# Altium project DMPro16.PrjPcb (part 1 of 3)
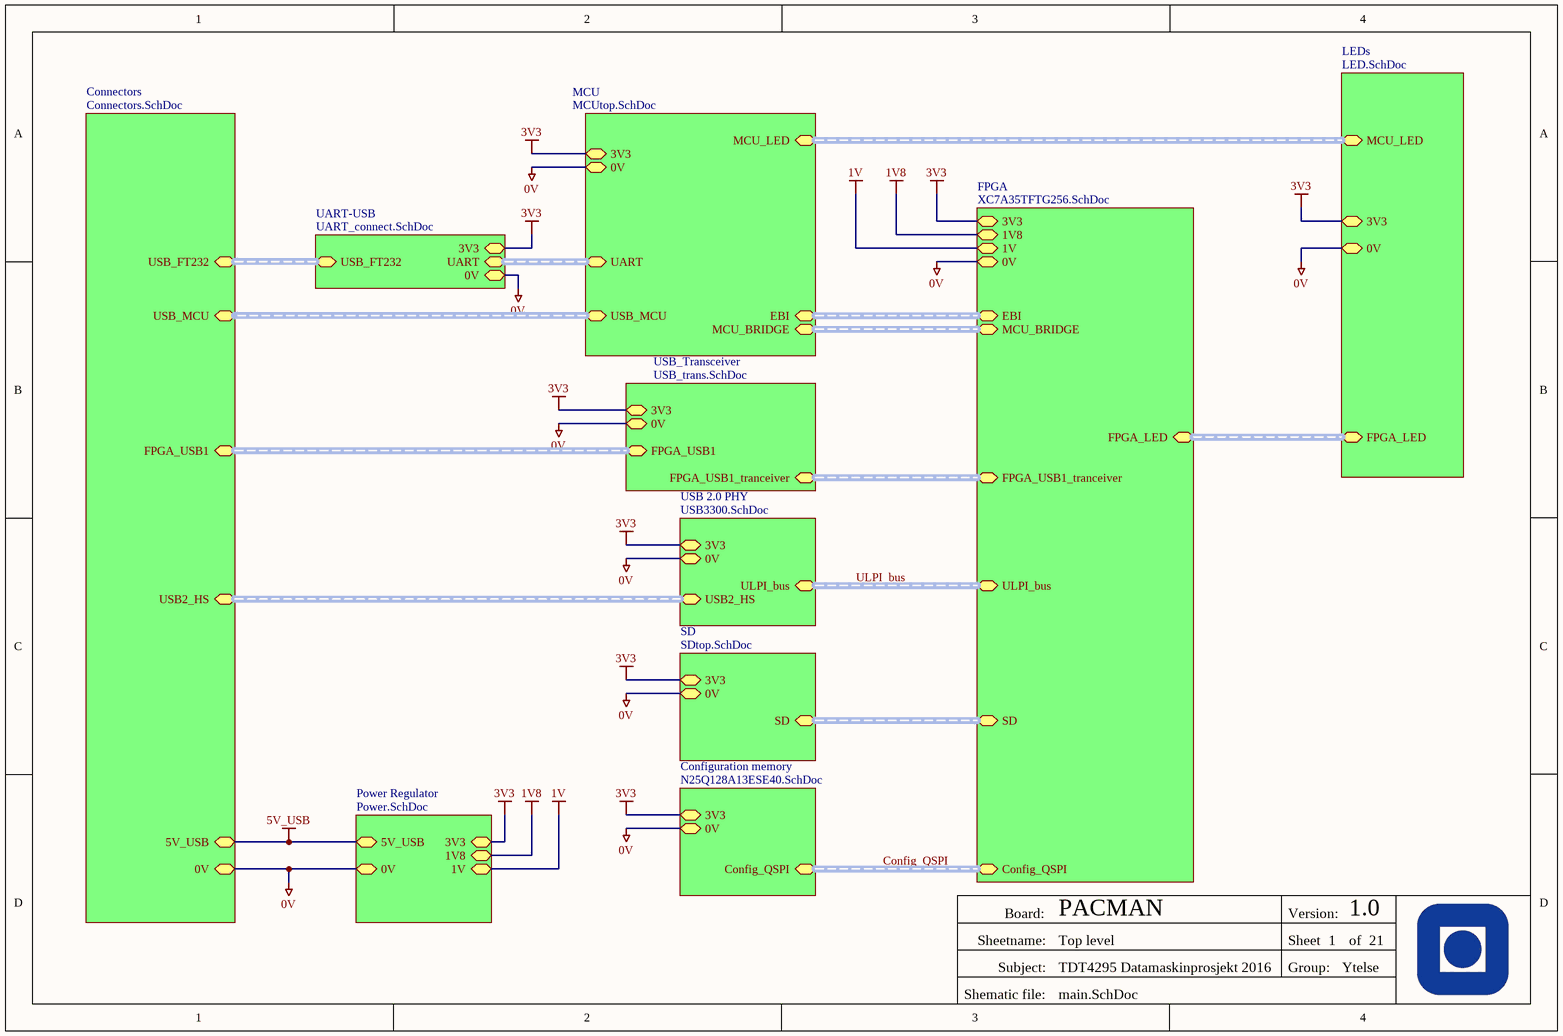
[diagram p0: main.SchDoc]
Version: 1.0; Subject: TDT4295 Datamaskinprosjekt 2016; Groupname: Ytelse; BoardName: PACMAN
21 sheets, 240 parts. Net scope: strictly hierarchical (ports join the sheet entries above them; power ports are local).
Board file: pcb.PcbDoc
Sheets:
  main.SchDoc
    MCU = MCUtop.SchDoc
      MCU Power = EFM32_power.SchDoc
      MCU IO = EFM32_IO.SchDoc
    FPGA = XC7A35TFTG256.SchDoc
      Power Supply = XC7A35TFTG256_power.SchDoc
      Configuration = XC7A35TFTG256_config.SchDoc
        BANK14 = XC7A35TFTG256_bank14.SchDoc
        BANK0 = XC7A35TFTG256_bank0.SchDoc
      XC7A35TFTG256_IO = XC7A35TFTG256_IO.SchDoc
        Bank15 = XC7A35TFTG256_bank15.SchDoc
        Bank34 = XC7A35TFTG256_bank34.SchDoc
        Bank35 = XC7A35TFTG256_bank35.SchDoc
    SD = SDtop.SchDoc
    Power Regulator = Power.SchDoc
    Configuration memory = N25Q128A13ESE40.SchDoc
    USB 2.0 PHY = USB3300.SchDoc
    LEDs = LED.SchDoc
    Connectors = Connectors.SchDoc
    USB_Transceiver = USB_trans.SchDoc
    UART-USB = UART_connect.SchDoc

## Sheet main.SchDoc
size A4; DocumentNumber: 1; SheetNumber: 1; SheetTotal: 21; SheetName: Top level

### Sub-sheets
Configuration memory = N25Q128A13ESE40.SchDoc: Config_QSPI (harness QSPI), 3V3, 0V
Connectors = Connectors.SchDoc: USB_MCU (harness USB), USB2_HS (harness USB), FPGA_USB1 (harness USB), 5V_USB, 0V, USB_FT232 (harness USB)
FPGA = XC7A35TFTG256.SchDoc: EBI (harness EBI), MCU_BRIDGE (harness MCU_CTRL_LOGIC), SD (harness SD_card), 3V3, 1V8, 1V, Config_QSPI (harness QSPI), FPGA_LED (harness LED_Harness), ULPI_bus (harness ULPI), 0V, FPGA_USB1_tranceiver (harness USB1_FS_harness)
LEDs = LED.SchDoc: FPGA_LED (harness LED_Harness), MCU_LED, 0V, 3V3
MCU = MCUtop.SchDoc: 3V3, 0V, EBI (harness EBI), MCU_BRIDGE (harness MCU_CTRL_LOGIC), USB_MCU (harness USB), MCU_LED (harness LED_Harness), UART (harness UART)
Power Regulator = Power.SchDoc: 5V_USB, 0V, 3V3, 1V8, 1V
SD = SDtop.SchDoc: SD (harness SD_card), 3V3, 0V
UART-USB = UART_connect.SchDoc: USB_FT232 (harness USB), UART (harness UART), 0V, 3V3
USB 2.0 PHY = USB3300.SchDoc: 3V3, 0V, USB2_HS (harness USB), ULPI_bus (harness ULPI)
USB_Transceiver = USB_trans.SchDoc: 3V3, 0V, FPGA_USB1 (harness USB), FPGA_USB1_tranceiver (harness USB1_FS_harness)

### Nets
0V: sheet MCU/0V, sheet FPGA/0V, sheet SD/0V, sheet Power Regulator/0V, sheet Configuration memory/0V, sheet USB 2.0 PHY/0V, sheet LEDs/0V, sheet Connectors/0V, sheet USB_Transceiver/0V, sheet UART-USB/0V
1V: sheet FPGA/1V, sheet Power Regulator/1V
1V8: sheet FPGA/1V8, sheet Power Regulator/1V8
3V3: sheet MCU/3V3, sheet FPGA/3V3, sheet SD/3V3, sheet Power Regulator/3V3, sheet Configuration memory/3V3, sheet USB 2.0 PHY/3V3, sheet LEDs/3V3, sheet USB_Transceiver/3V3, sheet UART-USB/3V3
5V_USB: sheet Power Regulator/5V_USB, sheet Connectors/5V_USB

### Buses and harness runs
harness Config_QSPI = sheet Configuration memory/Config_QSPI = sheet FPGA/Config_QSPI
harness sheet Connectors/FPGA_USB1 = sheet USB_Transceiver/FPGA_USB1
harness sheet Connectors/USB2_HS = sheet USB 2.0 PHY/USB2_HS
harness sheet Connectors/USB_FT232 = sheet UART-USB/USB_FT232
harness sheet Connectors/USB_MCU = sheet MCU/USB_MCU
harness sheet FPGA/EBI = sheet MCU/EBI
harness sheet FPGA/FPGA_LED = sheet LEDs/FPGA_LED
harness sheet FPGA/FPGA_USB1_tranceiver = sheet USB_Transceiver/FPGA_USB1_tranceiver
harness sheet FPGA/MCU_BRIDGE = sheet MCU/MCU_BRIDGE
harness sheet FPGA/SD = sheet SD/SD
harness sheet LEDs/MCU_LED = sheet MCU/MCU_LED
harness sheet MCU/UART = sheet UART-USB/UART
harness ULPI_bus = sheet FPGA/ULPI_bus = sheet USB 2.0 PHY/ULPI_bus

### Notes on the sheet
- Board:
- Version:
- Sheetname:
- Subject:
- Group:
- Sheet
- of
- Shematic file:

## Sheet MCUtop.SchDoc
size A4; DocumentNumber: 4; SheetNumber: 4; SheetTotal: 21; SheetName: Microcontroller Top Level
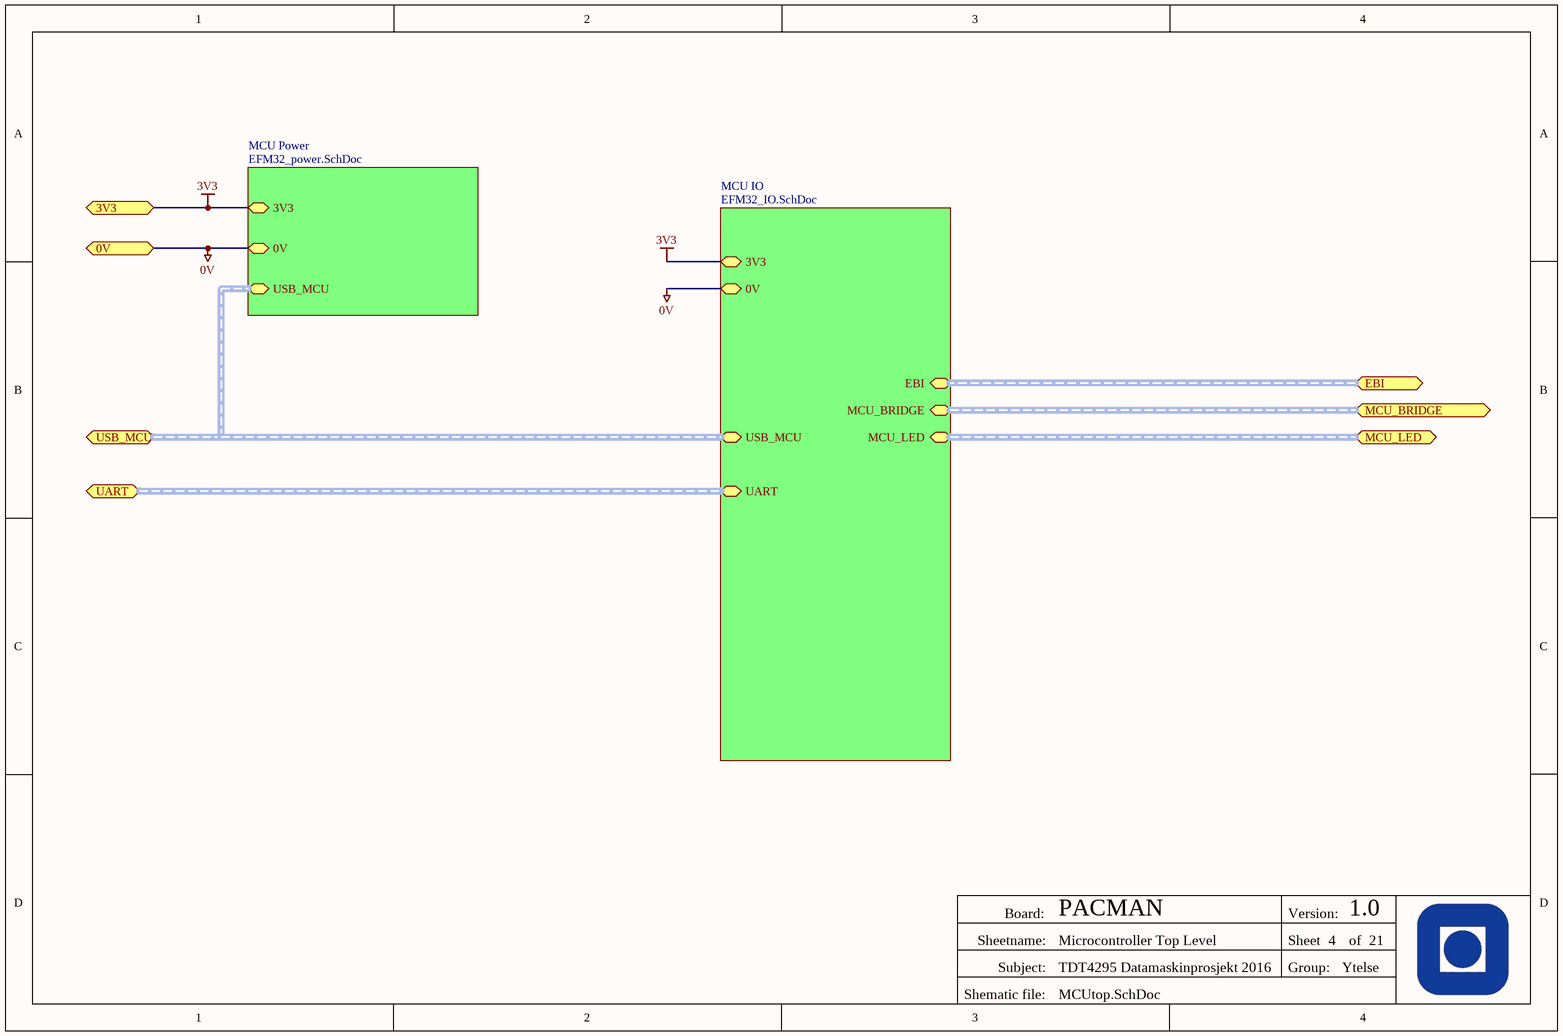
[diagram p1: MCUtop.SchDoc]

### Sub-sheets
MCU IO = EFM32_IO.SchDoc: MCU_BRIDGE (harness MCU_CTRL_LOGIC), USB_MCU (harness USB), EBI (harness EBI), MCU_LED (harness LED_Harness), 3V3, 0V, UART (harness UART)
MCU Power = EFM32_power.SchDoc: 3V3, 0V, USB_MCU (harness USB)

### Ports
0V, 3V3, EBI (harness EBI), MCU_BRIDGE (harness MCU_CTRL_LOGIC), MCU_LED (harness LED_Harness), UART (harness UART), USB_MCU (harness USB)

### Nets
0V: port 0V, sheet MCU Power/0V, sheet MCU IO/0V
3V3: port 3V3, sheet MCU Power/3V3, sheet MCU IO/3V3

### Buses and harness runs
harness port EBI = sheet MCU IO/EBI
harness port MCU_BRIDGE = sheet MCU IO/MCU_BRIDGE
harness port MCU_LED = sheet MCU IO/MCU_LED
harness port UART = sheet MCU IO/UART
harness port USB_MCU = sheet MCU IO/USB_MCU = sheet MCU Power/USB_MCU

### Notes on the sheet
- Board:
- Version:
- Sheetname:
- Subject:
- Group:
- Sheet
- of
- Shematic file:

## Sheet EFM32_power.SchDoc
size A4; DocumentNumber: 6; SheetNumber: 6; SheetTotal: 21; SheetName: Microcontroller Power Distribution
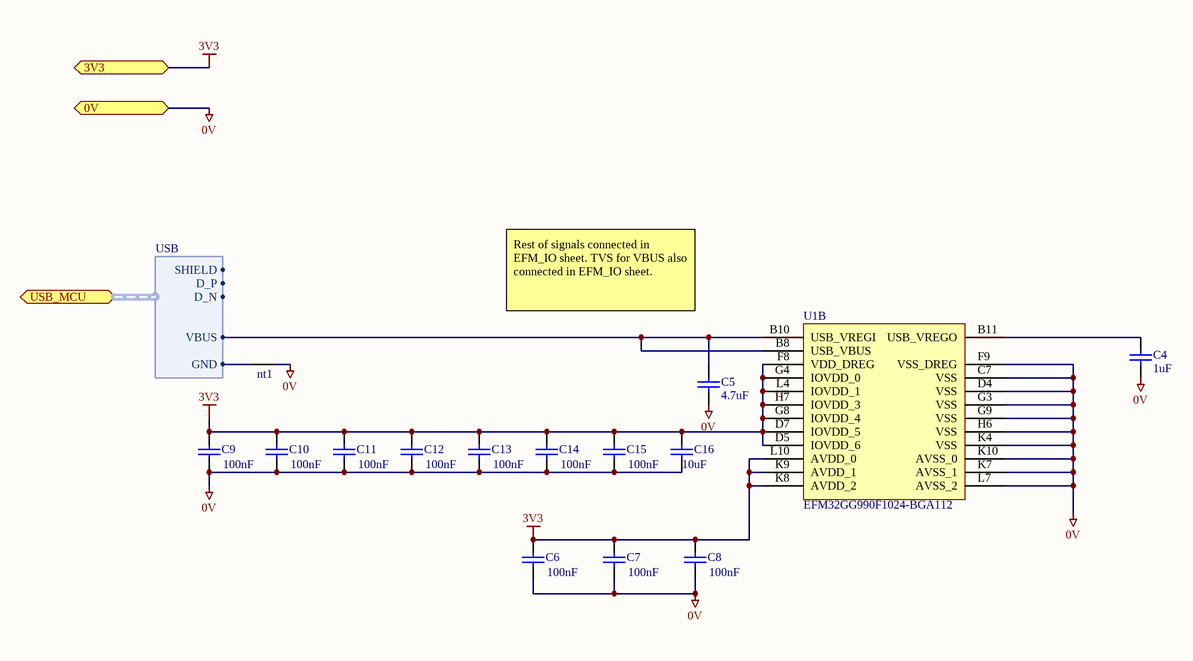
[diagram p2: EFM32_power.SchDoc]

### Parts
C4  value 1uF  [CAPC0603(1608)100_M]  (hidden comment: CAP 1uF 16V 0603(1608))
C5  value 4.7uF  [CAPC0603(1608)100_M]  (hidden comment: CAP 4.7uF 16V 0603(1608))
C6  value 100nF  [CAPC0603(1608)100_M]  (hidden comment: CAP 100nF 16V 0603(1608))
C7  value 100nF  [CAPC0603(1608)100_M]  (hidden comment: CAP 100nF 16V 0603(1608))
C8  value 100nF  [CAPC0603(1608)100_M]  (hidden comment: CAP 100nF 16V 0603(1608))
C9  value 100nF  [CAPC0603(1608)100_M]  (hidden comment: CAP 100nF 16V 0603(1608))
C10  value 100nF  [CAPC0603(1608)100_M]  (hidden comment: CAP 100nF 16V 0603(1608))
C11  value 100nF  [CAPC0603(1608)100_M]  (hidden comment: CAP 100nF 16V 0603(1608))
C12  value 100nF  [CAPC0603(1608)100_M]  (hidden comment: CAP 100nF 16V 0603(1608))
C13  value 100nF  [CAPC0603(1608)100_M]  (hidden comment: CAP 100nF 16V 0603(1608))
C14  value 100nF  [CAPC0603(1608)100_M]  (hidden comment: CAP 100nF 16V 0603(1608))
C15  value 100nF  [CAPC0603(1608)100_M]  (hidden comment: CAP 100nF 16V 0603(1608))
C16  value 10uF  [CAPC0603(1608)100_M]  (hidden comment: CAP 10uF 10V 0603(1608))
nt1  net tie  [net tie]  (value not drawn)  (net tie, no BOM)
U1  EFM32GG990F1024-BGA112  [ENMR-BGA112]  (part B of 2)

### Ports
0V, 3V3, USB_MCU (harness USB)

### Harnesses
USB: D_P, D_N, VBUS, GND, SHIELD

### Nets
0V: C4.1 C5.1 C6.1 C7.1 C8.1 C9.1 C10.1 C11.1 C12.1 C13.1 C14.1 C15.1 C16.1 nt1.1 U1.C7(VSS) U1.D4(VSS) U1.F9(VSS_DREG) U1.G3(VSS) U1.G9(VSS) U1.H6(VSS) U1.K4(VSS) U1.K7(AVSS_1) U1.K10(AVSS_0) U1.L7(AVSS_2) ; port 0V
3V3: C6.2 C7.2 C8.2 C9.2 C10.2 C11.2 C12.2 C13.2 C14.2 C15.2 C16.2 U1.D5(IOVDD_6) U1.D7(IOVDD_5) U1.F8(VDD_DREG) U1.G4(IOVDD_0) U1.G8(IOVDD_4) U1.H7(IOVDD_3) U1.K8(AVDD_2) U1.K9(AVDD_1) U1.L4(IOVDD_1) U1.L10(AVDD_0) ; port 3V3
NetC4_2: C4.2 U1.B11(USB_VREGO)
NetC5_2: C5.2 U1.B8(USB_VBUS) U1.B10(USB_VREGI) ; port USB_MCU.VBUS
Netnt1_0: nt1.0 ; port USB_MCU.GND

### Notes on the sheet
- Rest of signals connected in EFM_IO sheet. TVS for VBUS also connected in EFM_IO sheet.
- Board:
- Version:
- Sheetname:
- Subject:
- Group:
- Sheet
- of
- Shematic file:

### Library data of the parts
C4 = CMP-1035-02736-1: CAP 1uF 16V ±5% 0603 (1608 Metric) Thickness 1mm SMD; Case-Metric: 1608; Case-EIA: 0603; Tolerance: Â±5%; Technology: SMT; Max Thickness: 1 mm; Rated Voltage: 16 V
C5 = CMP-1035-02788-1: CAP 4.7uF 16V ±10% 0603 (1608 Metric) Thickness 1mm SMD; Case-Metric: 1608; Tolerance: Â±10%; Case-EIA: 0603; Technology: SMT; Rated Voltage: 16 V; Max Thickness: 1 mm
C6-C15 = CMP-1035-02583-1: CAP 100nF 16V ±5% 0603 (1608 Metric) Thickness 1mm SMD; Tolerance: Â±5%; Case-Metric: 1608; Case-EIA: 0603; Rated Voltage: 16 V; Max Thickness: 1 mm; Technology: SMT
C16 = CMP-1035-02799-1: CAP 10uF 10V ±10% 0603 (1608 Metric) Thickness 1mm SMD; Tolerance: Â±10%; Case-Metric: 1608; Case-EIA: 0603; Max Thickness: 1 mm; Technology: SMT; Rated Voltage: 10 V
nt1 = net tie: used to connect nets without transferring net name
U1 = CMP-0270-00024-1: EFM32 Giant Gecko, M3 ARM Cortex CPU, 1024 KB Flash, 128 KB RAM, 1.85 - 3.8 V Supply, 48 MHz Max Speed, -40 to 85 degC, 112-Pin BGA, RoHS Compliant; LESENSE: Y; RAM (KB): 128; Flash (KB): 1024; LCD: 8x34; OPAMPS: 3; GPIO: 87; Max Speed (MHz): 48; ARM Cortex CPU: M3; DatasheetVersion: Rev 1.00; PartNumber: EFM32GG990F1024-BGA112; ComponentLink3Description: Package Specification; Subcategory: EFM32 Giant Gecko; PackageReference: BGA112; ComponentLink3URL: http://cdn.energymicro.com/dl/devices/pdf/d0007_efm32g290_datasheet.pdf; ComponentLink2Description: Datasheet; USB: Y; PackageDescription: 112-Pin Ball Grid Array, Body 10 x 10 mm, Pitch 0.8 mm; PackageVersion: Rev. 97SPP01315A_X03_06Jun11; ComponentLink1Description: Manufacturer URL; Supply Voltage (V): 1.85 - 3.8; Mounting Technology: Surface Mount; ComponentLink1URL: http://www.energymicro.com/; Generic Part Number: EFM32GG990; ComponentLink2URL: http://cdn.energymicro.com/dl/devices/pdf/d0046_efm32gg990_datasheet.pdf; PartId: 1

## Sheet EFM32_IO.SchDoc
size A4; DocumentNumber: 5; SheetNumber: 5; SheetTotal: 21; SheetName: Microcontroller IO
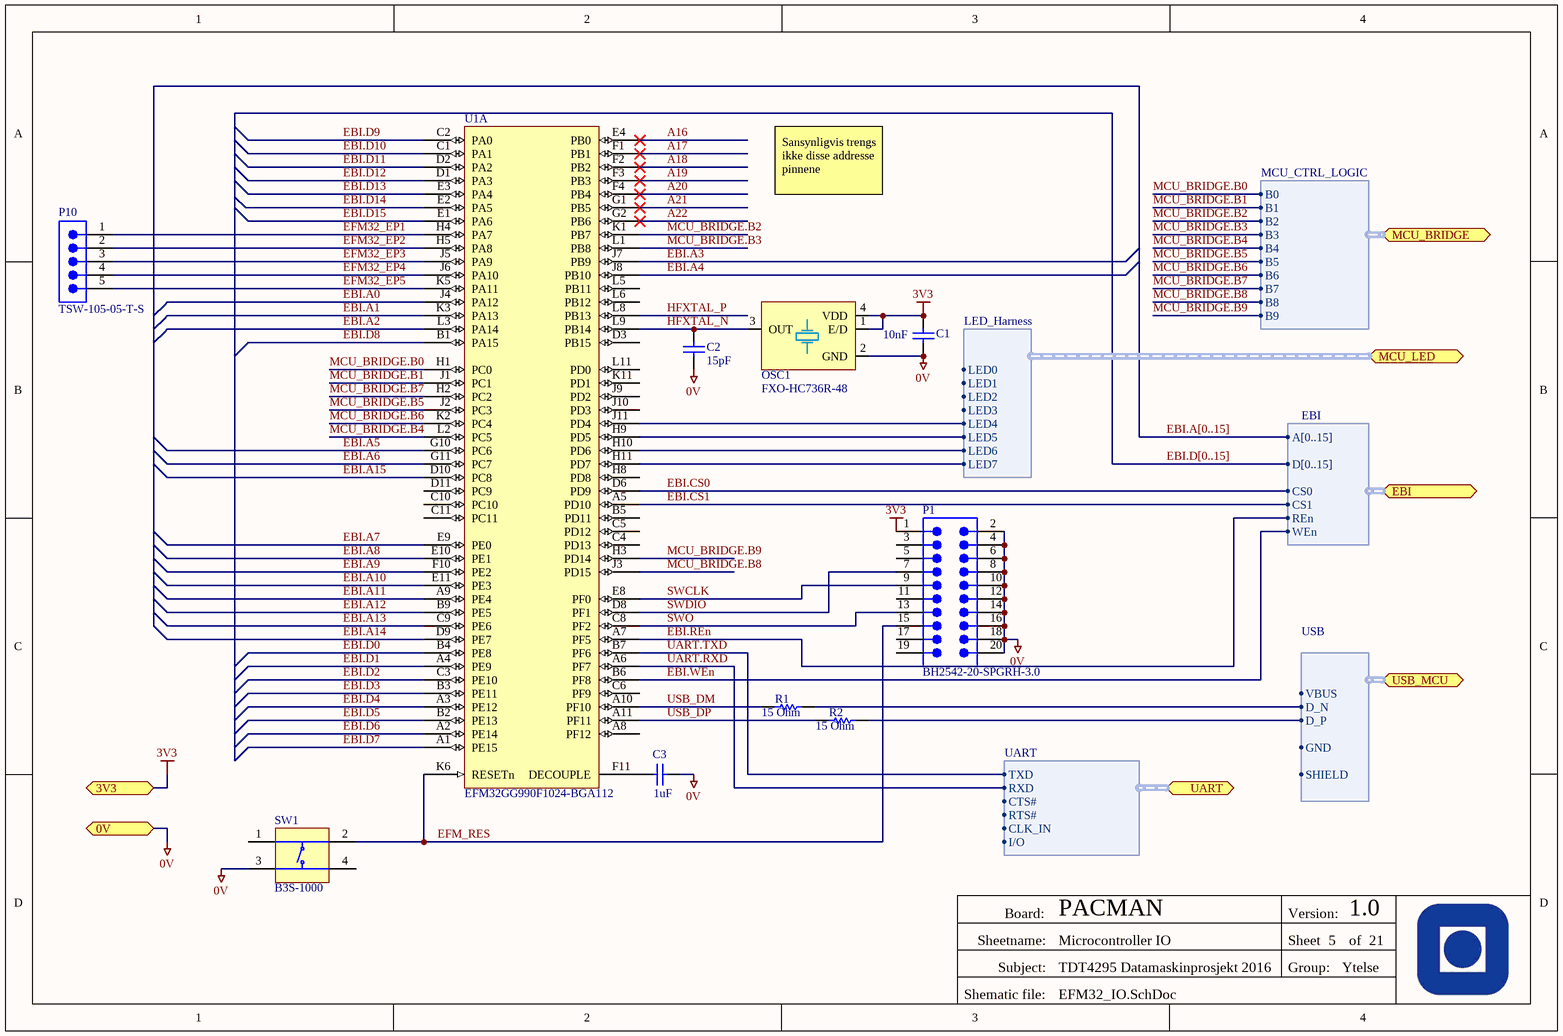
[diagram p3: EFM32_IO.SchDoc]

### Parts
C1  value 10nF  [CAPC0603(1608)100_L]  (hidden comment: CAP 10nF 16V 0603(1608))
C2  value 15pF  [CAPC0603(1608)100_N]  (hidden comment: CAP 15pF 16V 0603(1608))
C3  value 1uF  [CAPC0603(1608)100_M]  (hidden comment: CAP 1uF 16V 0603(1608))
OSC1  FXO-HC736R-48  [FXO-HC73]
P1  BH2542-20-SPGRH-3.0  [PCE-BH2542-20-SPGRH-3.0]
P10  TSW-105-05-T-S  [SMTC-TSW-105-05-X-S]
R1  value 15 Ohm  [RESC0603(1608)_L]  (hidden comment: 15R 5% 0603(1608))
R2  value 15 Ohm  [RESC0603(1608)_L]  (hidden comment: 15R 5% 0603(1608))
SW1  B3S-1000  [OMRON-B3S-1000-4_V]
U1  EFM32GG990F1024-BGA112  [ENMR-BGA112]  (part A of 2)

### Ports
0V, 3V3, EBI (harness EBI), MCU_BRIDGE (harness MCU_CTRL_LOGIC), MCU_LED (harness LED_Harness), UART (harness UART), USB_MCU (harness USB)

### Harnesses
EBI: A[0..15], D[0..15], CS0, CS1, REn, WEn
MCU_CTRL_LOGIC: B0, B1, B2, B3, B4, B5, B6, B7, B8, B9
USB: D_P, D_N, VBUS, GND, SHIELD
LED_Harness: LED0, LED1, LED2, LED3, LED4, LED5, LED6, LED7
UART: TXD, RXD, CTS#, RTS#, CLK_IN, I/O

### Nets
0V: C1.1 C2.1 C3.2 OSC1.2(GND) P1.2 P1.4 P1.6 P1.8 P1.10 P1.12 P1.14 P1.16 P1.18 P1.20 SW1.3 ; port 0V
3V3: C1.2 OSC1.1(E/D) OSC1.4(VDD) P1.1 ; port 3V3
A16: U1.E4(PB0)
A17: U1.F1(PB1)
A18: U1.F2(PB2)
A19: U1.F3(PB3)
A20: U1.F4(PB4)
A21: U1.G1(PB5)
A22: U1.G2(PB6)
EBI.A0: U1.J4(PA12)
EBI.A1: U1.K3(PA13)
EBI.A2: U1.L3(PA14)
EBI.A3: U1.J7(PB9)
EBI.A4: U1.J8(PB10)
EBI.A5: U1.G10(PC6)
EBI.A6: U1.G11(PC7)
EBI.A7: U1.E9(PE0)
EBI.A8: U1.E10(PE1)
EBI.A9: U1.F10(PE2)
EBI.A10: U1.E11(PE3)
EBI.A11: U1.A9(PE4)
EBI.A12: U1.B9(PE5)
EBI.A13: U1.C9(PE6)
EBI.A14: U1.D9(PE7)
EBI.A15: U1.D10(PC8)
EBI.CS0: U1.D6(PD9) ; port EBI.CS0
EBI.CS1: U1.A5(PD10) ; port EBI.CS1
EBI.D0: U1.B4(PE8)
EBI.D1: U1.A4(PE9)
EBI.D2: U1.C3(PE10)
EBI.D3: U1.B3(PE11)
EBI.D4: U1.A3(PE12)
EBI.D5: U1.B2(PE13)
EBI.D6: U1.A2(PE14)
EBI.D7: U1.A1(PE15)
EBI.D8: U1.B1(PA15)
EBI.D9: U1.C2(PA0)
EBI.D10: U1.C1(PA1)
EBI.D11: U1.D2(PA2)
EBI.D12: U1.D1(PA3)
EBI.D13: U1.E3(PA4)
EBI.D14: U1.E2(PA5)
EBI.D15: U1.E1(PA6)
EBI.REn: U1.A7(PF5) ; port EBI.REn
EBI.WEn: U1.B6(PF8) ; port EBI.WEn
EFM32_EP1: P10.1 U1.H4(PA7)
EFM32_EP2: P10.2 U1.H5(PA8)
EFM32_EP3: P10.3 U1.J5(PA9)
EFM32_EP4: P10.4 U1.J6(PA10)
EFM32_EP5: P10.5 U1.K5(PA11)
EFM_RES: P1.15 SW1.2 U1.K6(RESETn)
HFXTAL_N: C2.2 OSC1.3(OUT) U1.L9(PB14)
HFXTAL_P: U1.L8(PB13)
MCU_BRIDGE.B0: U1.H1(PC0) ; port MCU_BRIDGE.B0
MCU_BRIDGE.B1: U1.J1(PC1) ; port MCU_BRIDGE.B1
MCU_BRIDGE.B2: U1.K1(PB7) ; port MCU_BRIDGE.B2
MCU_BRIDGE.B3: U1.L1(PB8) ; port MCU_BRIDGE.B3
MCU_BRIDGE.B4: U1.L2(PC5) ; port MCU_BRIDGE.B4
MCU_BRIDGE.B5: U1.J2(PC3) ; port MCU_BRIDGE.B5
MCU_BRIDGE.B6: U1.K2(PC4) ; port MCU_BRIDGE.B6
MCU_BRIDGE.B7: U1.H2(PC2) ; port MCU_BRIDGE.B7
MCU_BRIDGE.B8: U1.J3(PD15) ; port MCU_BRIDGE.B8
MCU_BRIDGE.B9: U1.H3(PD14) ; port MCU_BRIDGE.B9
SWCLK: P1.9 U1.E8(PF0)
SWDIO: P1.7 U1.D8(PF1)
SWO: P1.13 U1.C8(PF2)
UART.RXD: U1.A6(PF7) ; port UART.RXD
UART.TXD: U1.B7(PF6) ; port UART.TXD
USB_DM: R1.1 U1.A10(PF10)
USB_DP: R2.1 U1.A11(PF11)
NetC3_1: C3.1 U1.F11(DECOUPLE)
NetD2_1: R1.2 ; port USB_MCU.D_N
NetD2_3: R2.2 ; port USB_MCU.D_P
NetLED9_2: U1.J11(PD4) ; port MCU_LED.LED4
NetLED10_2: U1.H9(PD5) ; port MCU_LED.LED5
NetLED11_2: U1.H10(PD6) ; port MCU_LED.LED6
NetLED12_2: U1.H11(PD7) ; port MCU_LED.LED7

Not connected (* = marked no-connect by the designer): P1 3 5 11 17 19; SW1 1 4; U1 A8(PF12) B5(PD11) C4(PD13) C5(PD12) C6(PF9) C10(PC10) C11(PC11) D3(PB15) D11(PC9) H8(PD8) J9(PD2) J10(PD3) K11(PD1) L5(PB11) L6(PB12) L11(PD0)

### Buses and harness runs
bus EBI.A[0..15]
bus EBI.D[0..15]

### Notes on the sheet
- Sansynligvis trengs ikke disse addresse pinnene
- Board:
- Version:
- Sheetname:
- Subject:
- Group:
- Sheet
- of
- Shematic file:

### Library data of the parts
C1 = CMP-1035-02309-1: CAP 10nF 16V ±1% 0603 (1608 Metric) Thickness 1mm SMD; Case-Metric: 1608; Tolerance: Â±1%; Case-EIA: 0603; Rated Voltage: 16 V; Technology: SMT; Max Thickness: 1 mm
C2 = CMP-1035-00665-1: CAP 15pF 16V ±0.25pF 0603 (1608 Metric) Thickness 1mm SMD; Case-Metric: 1608; Case-EIA: 0603; Tolerance: Â±0.25pF; Technology: SMT; Max Thickness: 1 mm; Rated Voltage: 16 V
C3 = CMP-1035-02737-1: CAP 1uF 16V ±10% 0603 (1608 Metric) Thickness 1mm SMD; Case-Metric: 1608; Tolerance: Â±10%; Case-EIA: 0603; Rated Voltage: 16 V; Max Thickness: 1 mm; Technology: SMT
P1 = CMP-0605-00003-2: Box Header, Pitch 2.54 mm, 2x10 Position, Height 9 mm, Tail Length 3 mm; Manufacturer: Pinchao Electronic; Insulator Material: NY-6T; Dielectric Withstaanding: AC 500 V; Insulator resistance (Min.): 1000 Megohms; Current Rating: 3 Amps; Pitch: 2.54 mm; Plating: Gold Flash; No. of positions: 20; No. of Rows: 2; ComponentLink1URL: http://www.suzhoupinchao.com/; Mounting Technology: Through Hole; Operating Temperature: -40 to 105 degC; ComponentLink1Description: Manufacturer URL; PackageReference: BH2542-20-SPGRH-3.0; PackageDescription: Box Header, Pitch 2.54 mm, 2x10 Position, Height 9 mm, Tail Length 3 mm; PartNumber: BH2542-20-SPGRH-3.0; Connector Type: Box Header
P10 = CMP-1024-00364-1: 0.025" SQ Post Header, Through-hole, Vertical, -55 to 105 degC, 2.54 mm Pitch, 5-Pin, Male, RoHS; Manufacturer: Samtec; Pitch: 2.54 mm; ComponentLink1URL: http://www.samtec.com; PackageReference: TSW-105-05-X-S; ComponentLink2URL: http://www.samtec.com/documents/webfiles/pdf/TSW_TH.PDF; ComponentLink2Description: Datasheet; Orientation: Vertical; ComponentLink1Description: Manufacturer URL; ComponentLink3URL: http://www.samtec.com/documents/webfiles/cpdf/TSW-XXX-XX-XXX-X-XX-XXX-MKT.pdf; Mounting Technology: Through-hole; PackageVersion: DM, 8/1988; DatasheetVersion: F-214; Temperature Range: -55 to 105 degC; PartNumber: TSW-105-05-T-S; PackageDescription: .025[0.64] SQ. Post Terminal Strip Assembly; RoHS: True; ComponentLink3Description: Package Specification
R1 R2 = CMP-1012-00030-1: 15R 0.1W 5% 0603 (1608 Metric)  SMD; Case-EIA: 0603; Case-Metric: 1608; Tolerance: 5 %; Technology: SMT; Power: 0.1 W
SW1 = CMP-1677-00001-3: Sealed Tactile Switch, SPST-NO, 3 to 24 V, -25 to 70 degC, 4-Pin SMD, RoHS, Bulk; Current Rating: 50 mA; Voltage Rating: 24 V; Packaging: Bulk; PackageDescription: 4-Pin Surface Mount Device, Body 6.6 x 6 mm; Height: 4.3 mm; RoHSCompliant: true; REACH SVHC: No SVHC; Package Quantity: 1500; Mounting Technology: Surface Mount; Contact Plating: Silver; PackageReference: B3S-1000; Min Operating Temperature: -25 degC; DatasheetVersion: 10/2014; Mount: Surface Mount; Length: 6.6 mm; Max Operating Temperature: 70 degC
U1 = CMP-0270-00024-1: as U1 on sheet EFM32_power; ARM Cortex CPU: M3; DatasheetVersion: Rev 1.00; PartNumber: EFM32GG990F1024-BGA112; ComponentLink3Description: Package Specification; Subcategory: EFM32 Giant Gecko; PackageReference: BGA112; ComponentLink3URL: http://cdn.energymicro.com/dl/devices/pdf/d0007_efm32g290_datasheet.pdf; ComponentLink2Description: Datasheet; USB: Y; PackageDescription: 112-Pin Ball Grid Array, Body 10 x 10 mm, Pitch 0.8 mm; PackageVersion: Rev. 97SPP01315A_X03_06Jun11; ComponentLink1Description: Manufacturer URL; Supply Voltage (V): 1.85 - 3.8; Mounting Technology: Surface Mount; ComponentLink1URL: http://www.energymicro.com/; Generic Part Number: EFM32GG990; ComponentLink2URL: http://cdn.energymicro.com/dl/devices/pdf/d0046_efm32gg990_datasheet.pdf; PartId: 1
OSC1 = FXO-HC736R-48: Supplier 1: Farnell; Supplier Part Number 1: 1641012RL

## Sheet XC7A35TFTG256.SchDoc
size A4; DocumentNumber: 13; SheetNumber: 13; SheetTotal: 21; SheetName: FPGA Top level
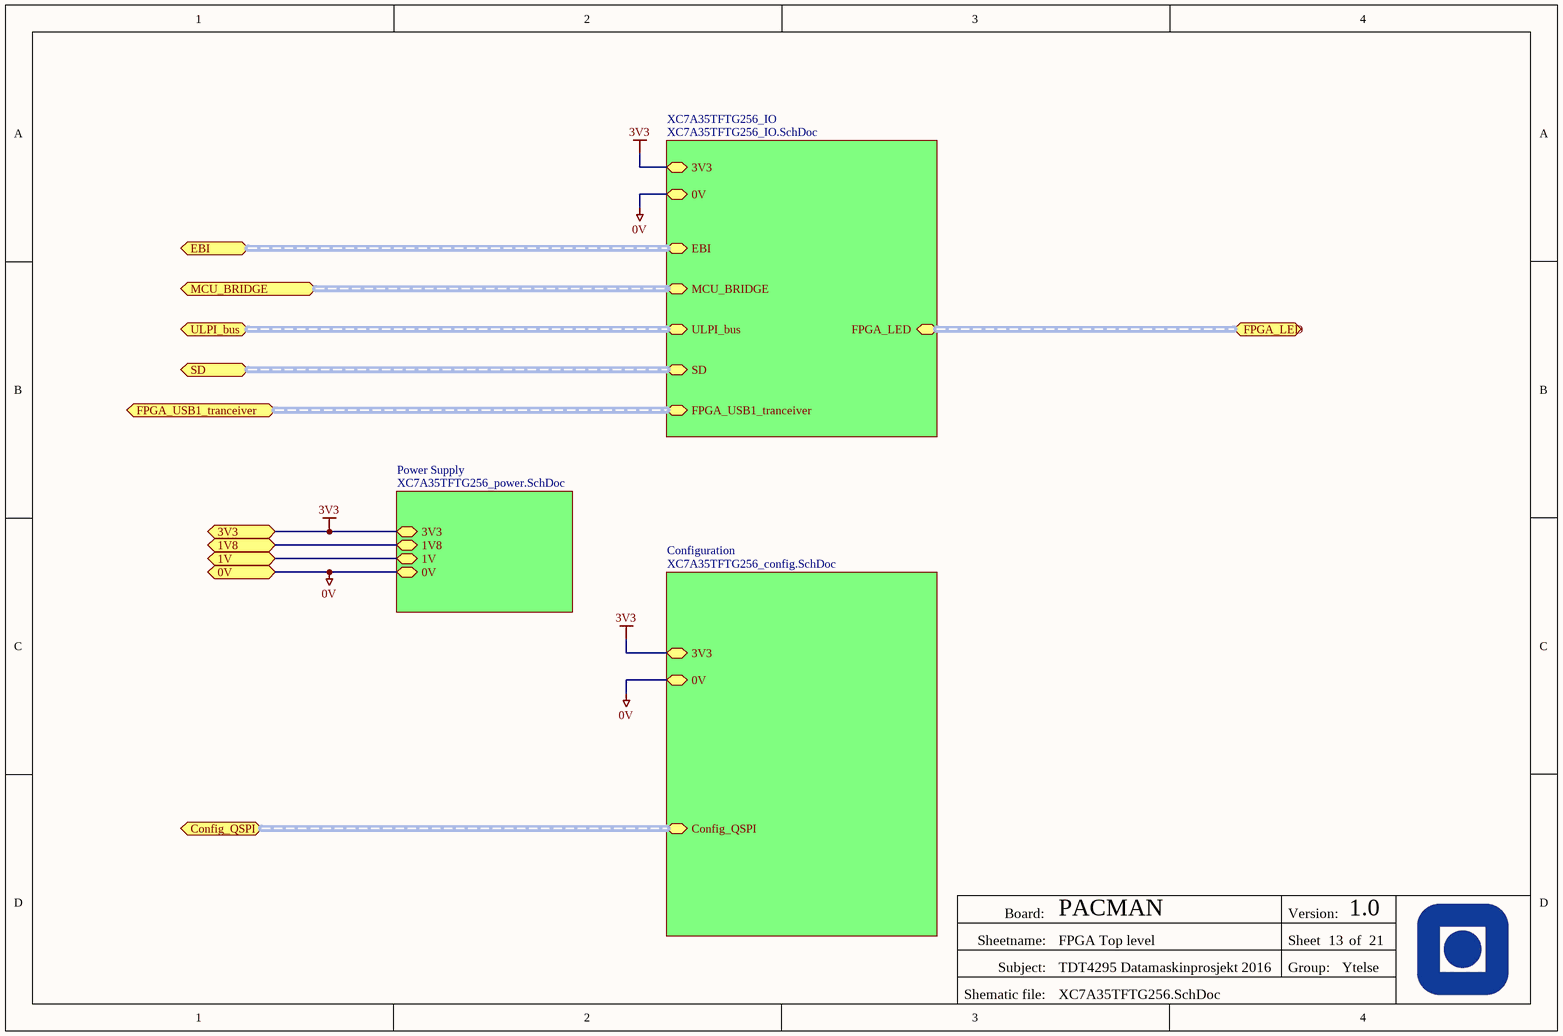
[diagram p4: XC7A35TFTG256.SchDoc]

### Sub-sheets
Configuration = XC7A35TFTG256_config.SchDoc: 3V3, 0V, Config_QSPI (harness QSPI)
Power Supply = XC7A35TFTG256_power.SchDoc: 3V3, 1V8, 1V, 0V
XC7A35TFTG256_IO = XC7A35TFTG256_IO.SchDoc: EBI (harness EBI), MCU_BRIDGE (harness MCU_CTRL_LOGIC), ULPI_bus (harness ULPI), FPGA_LED (harness LED_Harness), SD (harness Sd_card), 3V3, 0V, FPGA_USB1_tranceiver (harness USB1_FS_harness)

### Ports
0V, 1V, 1V8, 3V3, Config_QSPI (harness QSPI), EBI (harness EBI), FPGA_LED (harness LED_Harness), FPGA_USB1_tranceiver (harness USB1_FS_harness), MCU_BRIDGE (harness MCU_CTRL_LOGIC), SD (harness SD_card), ULPI_bus (harness ULPI)

### Nets
0V: port 0V, sheet Power Supply/0V, sheet Configuration/0V, sheet XC7A35TFTG256_IO/0V
1V: port 1V, sheet Power Supply/1V
1V8: port 1V8, sheet Power Supply/1V8
3V3: port 3V3, sheet Power Supply/3V3, sheet Configuration/3V3, sheet XC7A35TFTG256_IO/3V3

### Buses and harness runs
harness port Config_QSPI = sheet Configuration/Config_QSPI
harness port EBI = sheet XC7A35TFTG256_IO/EBI
harness port FPGA_LED = sheet XC7A35TFTG256_IO/FPGA_LED
harness port FPGA_USB1_tranceiver = sheet XC7A35TFTG256_IO/FPGA_USB1_tranceiver
harness port MCU_BRIDGE = sheet XC7A35TFTG256_IO/MCU_BRIDGE
harness port SD = sheet XC7A35TFTG256_IO/SD
harness port ULPI_bus = sheet XC7A35TFTG256_IO/ULPI_bus

### Notes on the sheet
- Board:
- Version:
- Sheetname:
- Subject:
- Group:
- Sheet
- of
- Shematic file:

## Sheet XC7A35TFTG256_power.SchDoc
size A4; DocumentNumber: 21; SheetNumber: 21; SheetTotal: 21; SheetName: FPGA Power Distribution
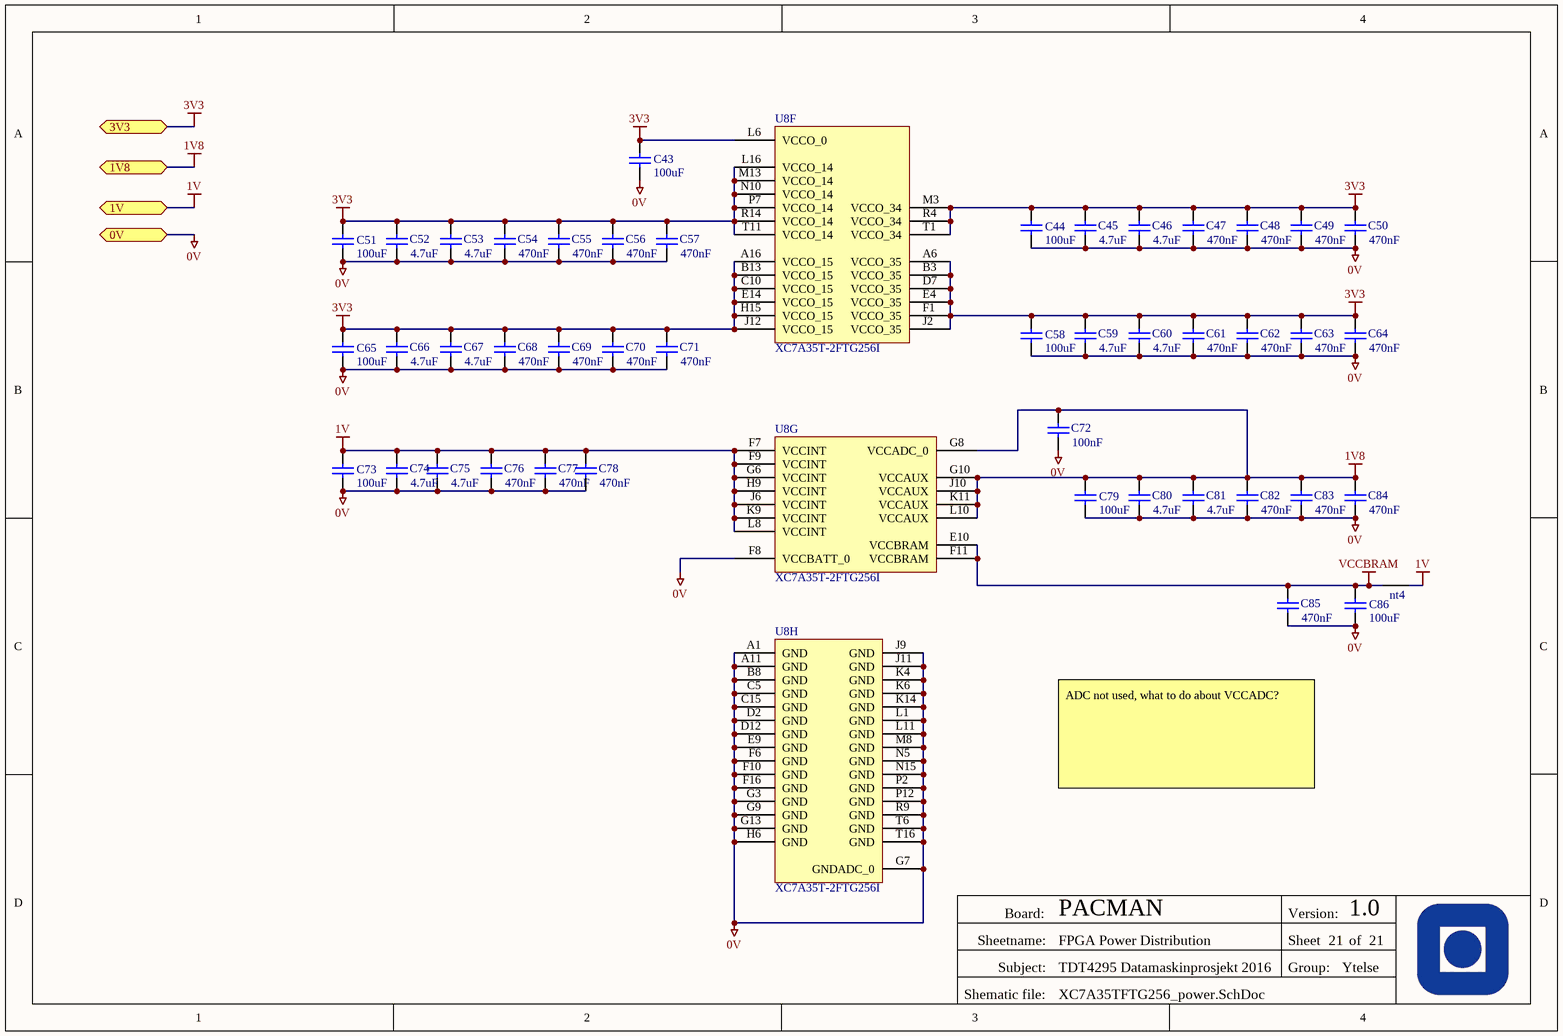
[diagram p5: XC7A35TFTG256_power.SchDoc]

### Parts
C43  value 100uF  [CAPC1210(3225)250_N]  (hidden comment: GRM32ER60J107ME20L)
C44  value 100uF  [CAPC1210(3225)250_N]  (hidden comment: GRM32ER60J107ME20L)
C45  value 4.7uF  [CAPC0603(1608)100_M]  (hidden comment: CAP 4.7uF 10V 0603(1608))
C46  value 4.7uF  [CAPC0603(1608)100_M]  (hidden comment: CAP 4.7uF 10V 0603(1608))
C47  value 470nF  [CAPC0603(1608)100_L]  (hidden comment: CAP 470nF 10V 0603(1608))
C48  value 470nF  [CAPC0603(1608)100_L]  (hidden comment: CAP 470nF 10V 0603(1608))
C49  value 470nF  [CAPC0603(1608)100_L]  (hidden comment: CAP 470nF 10V 0603(1608))
C50  value 470nF  [CAPC0603(1608)100_L]  (hidden comment: CAP 470nF 10V 0603(1608))
C51  value 100uF  [CAPC1210(3225)250_N]  (hidden comment: GRM32ER60J107ME20L)
C52  value 4.7uF  [CAPC0603(1608)100_M]  (hidden comment: CAP 4.7uF 10V 0603(1608))
C53  value 4.7uF  [CAPC0603(1608)100_M]  (hidden comment: CAP 4.7uF 10V 0603(1608))
C54  value 470nF  [CAPC0603(1608)100_L]  (hidden comment: CAP 470nF 10V 0603(1608))
C55  value 470nF  [CAPC0603(1608)100_L]  (hidden comment: CAP 470nF 10V 0603(1608))
C56  value 470nF  [CAPC0603(1608)100_L]  (hidden comment: CAP 470nF 10V 0603(1608))
C57  value 470nF  [CAPC0603(1608)100_L]  (hidden comment: CAP 470nF 10V 0603(1608))
C58  value 100uF  [CAPC1210(3225)250_N]  (hidden comment: GRM32ER60J107ME20L)
C59  value 4.7uF  [CAPC0603(1608)100_M]  (hidden comment: CAP 4.7uF 10V 0603(1608))
C60  value 4.7uF  [CAPC0603(1608)100_M]  (hidden comment: CAP 4.7uF 10V 0603(1608))
C61  value 470nF  [CAPC0603(1608)100_L]  (hidden comment: CAP 470nF 10V 0603(1608))
C62  value 470nF  [CAPC0603(1608)100_L]  (hidden comment: CAP 470nF 10V 0603(1608))
C63  value 470nF  [CAPC0603(1608)100_L]  (hidden comment: CAP 470nF 10V 0603(1608))
C64  value 470nF  [CAPC0603(1608)100_L]  (hidden comment: CAP 470nF 10V 0603(1608))
C65  value 100uF  [CAPC1210(3225)250_N]  (hidden comment: GRM32ER60J107ME20L)
C66  value 4.7uF  [CAPC0603(1608)100_M]  (hidden comment: CAP 4.7uF 10V 0603(1608))
C67  value 4.7uF  [CAPC0603(1608)100_M]  (hidden comment: CAP 4.7uF 10V 0603(1608))
C68  value 470nF  [CAPC0603(1608)100_L]  (hidden comment: CAP 470nF 10V 0603(1608))
C69  value 470nF  [CAPC0603(1608)100_L]  (hidden comment: CAP 470nF 10V 0603(1608))
C70  value 470nF  [CAPC0603(1608)100_L]  (hidden comment: CAP 470nF 10V 0603(1608))
C71  value 470nF  [CAPC0603(1608)100_L]  (hidden comment: CAP 470nF 10V 0603(1608))
C72  value 100nF  [CAPC0603(1608)100_M]  (hidden comment: CAP 100nF 16V 0603(1608))
C73  value 100uF  [CAPC1210(3225)250_N]  (hidden comment: GRM32ER60J107ME20L)
C74  value 4.7uF  [CAPC0603(1608)100_M]  (hidden comment: CAP 4.7uF 10V 0603(1608))
C75  value 4.7uF  [CAPC0603(1608)100_M]  (hidden comment: CAP 4.7uF 10V 0603(1608))
C76  value 470nF  [CAPC0603(1608)100_L]  (hidden comment: CAP 470nF 10V 0603(1608))
C77  value 470nF  [CAPC0603(1608)100_L]  (hidden comment: CAP 470nF 10V 0603(1608))
C78  value 470nF  [CAPC0603(1608)100_L]  (hidden comment: CAP 470nF 10V 0603(1608))
C79  value 100uF  [CAPC1210(3225)250_N]  (hidden comment: GRM32ER60J107ME20L)
C80  value 4.7uF  [CAPC0603(1608)100_M]  (hidden comment: CAP 4.7uF 10V 0603(1608))
C81  value 4.7uF  [CAPC0603(1608)100_M]  (hidden comment: CAP 4.7uF 10V 0603(1608))
C82  value 470nF  [CAPC0603(1608)100_L]  (hidden comment: CAP 470nF 10V 0603(1608))
C83  value 470nF  [CAPC0603(1608)100_L]  (hidden comment: CAP 470nF 10V 0603(1608))
C84  value 470nF  [CAPC0603(1608)100_L]  (hidden comment: CAP 470nF 10V 0603(1608))
C85  value 470nF  [CAPC0603(1608)100_L]  (hidden comment: CAP 470nF 10V 0603(1608))
C86  value 100uF  [CAPC1210(3225)250_N]  (hidden comment: GRM32ER60J107ME20L)
nt4  net tie  [net tie]  (value not drawn)  (net tie, no BOM)
U8  XC7A35T-2FTG256I  [FTG256]  (parts F,G,H of 8)

### Ports
0V, 1V, 1V8, 3V3

### Nets
0V: C43.1 C44.1 C45.1 C46.1 C47.1 C48.1 C49.1 C50.1 C51.1 C52.1 C53.1 C54.1 C55.1 C56.1 C57.1 C58.1 C59.1 C60.1 C61.1 C62.1 C63.1 C64.1 C65.1 C66.1 C67.1 C68.1 C69.1 C70.1 C71.1 C72.1 C73.1 C74.1 C75.1 C76.1 C77.1 C78.1 C79.1 C80.1 C81.1 C82.1 C83.1 C84.1 C85.1 C86.1 U8.A1(GND) U8.A11(GND) U8.B8(GND) U8.C5(GND) U8.C15(GND) U8.D2(GND) U8.D12(GND) U8.E9(GND) U8.F6(GND) U8.F8(VCCBATT_0) U8.F10(GND) U8.F16(GND) U8.G3(GND) U8.G7(GNDADC_0) U8.G9(GND) U8.G13(GND) U8.H6(GND) U8.J9(GND) U8.J11(GND) U8.K4(GND) U8.K6(GND) U8.K14(GND) U8.L1(GND) U8.L11(GND) U8.M8(GND) U8.N5(GND) U8.N15(GND) U8.P2(GND) U8.P12(GND) U8.R9(GND) U8.T6(GND) U8.T16(GND) ; port 0V
1V: C73.2 C74.2 C75.2 C76.2 C77.2 C78.2 nt4.1 U8.F7(VCCINT) U8.F9(VCCINT) U8.G6(VCCINT) U8.H9(VCCINT) U8.J6(VCCINT) U8.K9(VCCINT) U8.L8(VCCINT) ; port 1V
1V8: C72.2 C79.2 C80.2 C81.2 C82.2 C83.2 C84.2 U8.G8(VCCADC_0) U8.G10(VCCAUX) U8.J10(VCCAUX) U8.K11(VCCAUX) U8.L10(VCCAUX) ; port 1V8
3V3: C43.2 C44.2 C45.2 C46.2 C47.2 C48.2 C49.2 C50.2 C51.2 C52.2 C53.2 C54.2 C55.2 C56.2 C57.2 C58.2 C59.2 C60.2 C61.2 C62.2 C63.2 C64.2 C65.2 C66.2 C67.2 C68.2 C69.2 C70.2 C71.2 U8.A6(VCCO_35) U8.A16(VCCO_15) U8.B3(VCCO_35) U8.B13(VCCO_15) U8.C10(VCCO_15) U8.D7(VCCO_35) U8.E4(VCCO_35) U8.E14(VCCO_15) U8.F1(VCCO_35) U8.H15(VCCO_15) U8.J2(VCCO_35) U8.J12(VCCO_15) U8.L6(VCCO_0) U8.L16(VCCO_14) U8.M3(VCCO_34) U8.M13(VCCO_14) U8.N10(VCCO_14) U8.P7(VCCO_14) U8.R4(VCCO_34) U8.R14(VCCO_14) U8.T1(VCCO_34) U8.T11(VCCO_14) ; port 3V3
VCCBRAM: C85.2 C86.2 nt4.0 U8.E10(VCCBRAM) U8.F11(VCCBRAM)

### Notes on the sheet
- ADC not used, what to do about VCCADC?
- Board:
- Version:
- Sheetname:
- Subject:
- Group:
- Sheet
- of
- Shematic file:

### Library data of the parts
C43 C44 C51 C58 C65 C73 C79 C86 = GRM32ER60J107ME20L: 1210 100uF capacitor for artix-7 power decoupling; Supplier 1: Digi-Key; Supplier Part Number 1: 490-3390-1-ND
C45 C46 C52 C53 C59 C60 C66 C67 C74 C75 C80 C81 = CMP-1035-02785-1: CAP 4.7uF 10V ±10% 0603 (1608 Metric) Thickness 1mm SMD; Tolerance: Â±10%; Case-EIA: 0603; Case-Metric: 1608; Max Thickness: 1 mm; Technology: SMT; Rated Voltage: 10 V
C47-C50 C54-C57 C61-C64 C68-C71 C76-C78 C82-C85 = CMP-1035-02695-1: CAP 470nF 10V ±5% 0603 (1608 Metric) Thickness 1mm SMD; Tolerance: Â±5%; Case-EIA: 0603; Case-Metric: 1608; Rated Voltage: 10 V; Max Thickness: 1 mm; Technology: SMT
C72 = CMP-1035-02583-1: as C6 on sheet EFM32_power; Rated Voltage: 16 V; Max Thickness: 1 mm; Technology: SMT
nt4 = net tie: as nt1 on sheet EFM32_power
U8 = CMP-0383-00025-1: Artix-7 FPGA, 170 User I/Os, 0 GTP, 256-Ball BGA, Speed Grade 2, Industrial Grade, Pb-Free; Manufacturer: Xilinx; Logic Cells: 33280; GTP: 0; CMTs: 5; Available User I/O: 170; Total Block RAM: 1800 Kb; Speed Grades: 2; ComponentLink3Description: Pinout; ComponentLink4Description: Package Specification; ComponentLink2URL: http://www.xilinx.com/support/documentation/data_sheets/ds180_7Series_Overview.pdf; DatasheetVersion: Rev. 1.15; PackageVersion: Rev. 1.11; ComponentLink3URL: http://www.xilinx.com/support/documentation/user_guides/ug475_7Series_Pkg_Pinout.pdf; ComponentLink1Description: Manufacturer URL; PackageReference: FTG-256; ComponentLink1URL: http://www.xilinx.com/; ComponentLink4URL: http://www.xilinx.com/support/documentation/user_guides/ug475_7Series_Pkg_Pinout.pdf; Mounting Technology: Surface Mount; Maximum Distributed RAM: 400 Kb; PackageDescription: 256-Ball Wire-Bond Fine-Pitch Thin BGA, Body 17 x 17 mm, Pitch 1 mm; ComponentLink2Description: Datasheet; Operating Temperature Range: Industrial; PartNumber: XC7A35T-2FTG256I; PartId: 1

## Sheet XC7A35TFTG256_config.SchDoc
size A4; DocumentNumber: 14; SheetNumber: 14; SheetTotal: 21; SheetName: FPGA Configuration Top Level
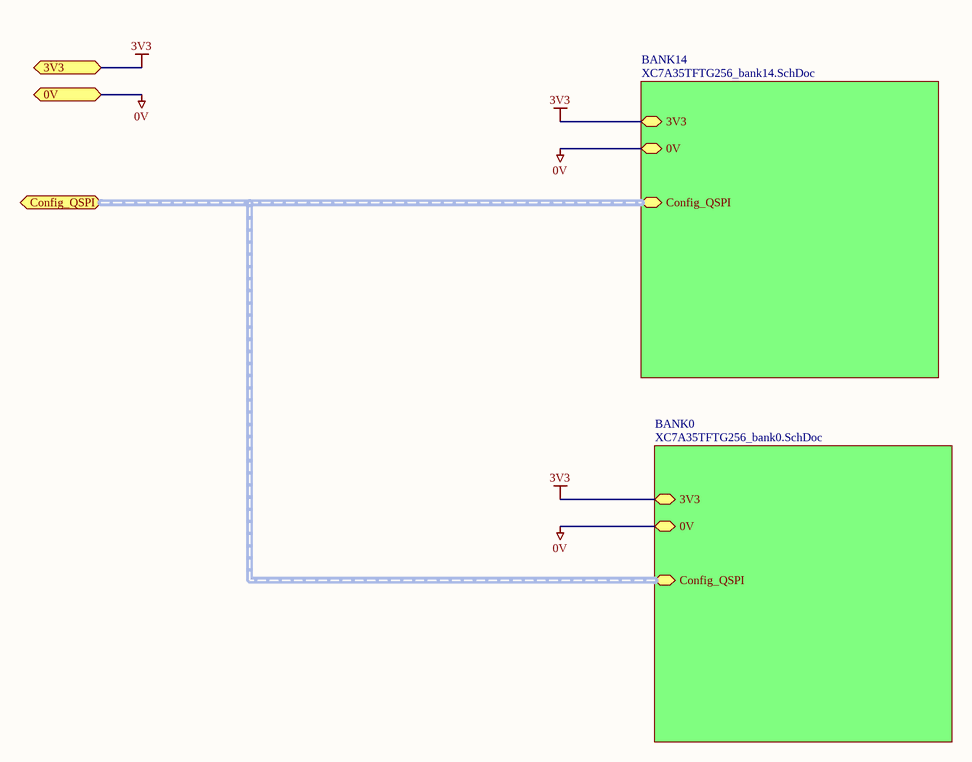
[diagram p6: XC7A35TFTG256_config.SchDoc]

### Sub-sheets
BANK0 = XC7A35TFTG256_bank0.SchDoc: Config_QSPI (harness QSPI), 0V, 3V3
BANK14 = XC7A35TFTG256_bank14.SchDoc: Config_QSPI (harness QSPI), 3V3, 0V

### Ports
0V, 3V3, Config_QSPI (harness QSPI)

### Nets
0V: port 0V, sheet BANK14/0V, sheet BANK0/0V
3V3: port 3V3, sheet BANK14/3V3, sheet BANK0/3V3

### Buses and harness runs
harness port Config_QSPI = sheet BANK0/Config_QSPI = sheet BANK14/Config_QSPI

### Notes on the sheet
- Board:
- Version:
- Sheetname:
- Subject:
- Group:
- Sheet
- of
- Shematic file:

## Sheet XC7A35TFTG256_bank14.SchDoc
size A4; DocumentNumber: 16; SheetNumber: 16; SheetTotal: 21; SheetName: FPGA Bank 14
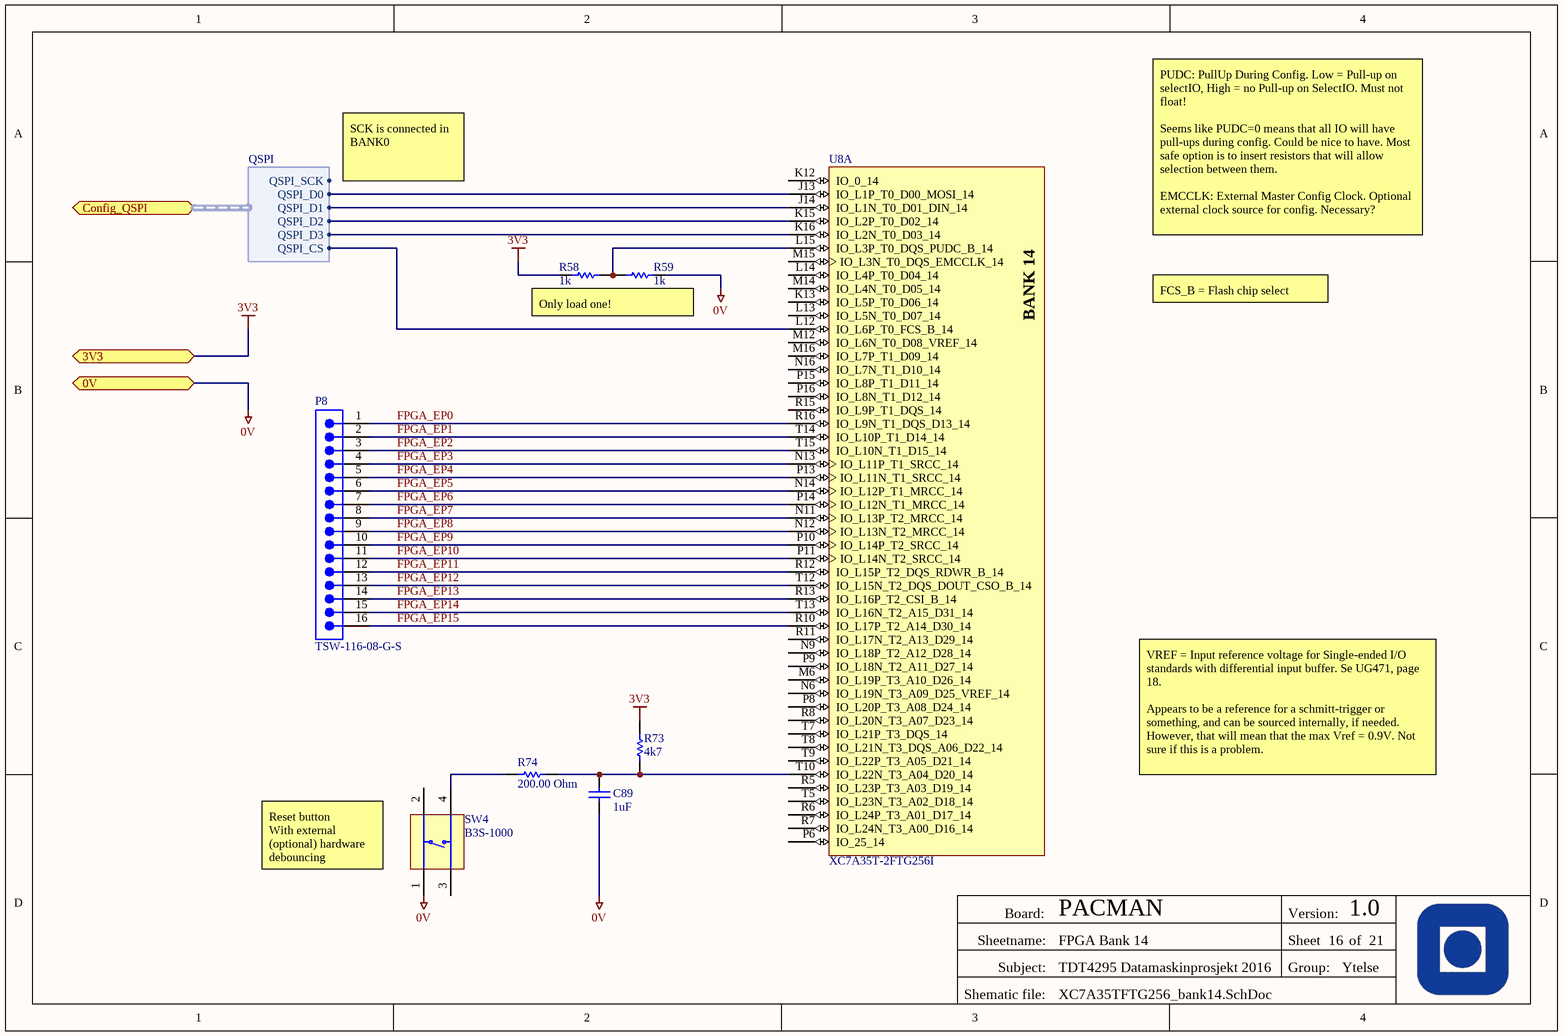
[diagram p7: XC7A35TFTG256_bank14.SchDoc]

### Parts
C89  value 1uF  [CAPC0603(1608)100_N]  (hidden comment: CAP 1uF 16V 0603(1608))
P8  TSW-116-08-G-S  [SMTC-TSW-116-08-X-S]
R58  value 1k  [RESC0603(1608)_L]  (hidden comment: 1K 5% 0603(1608))
R59  value 1k  [RESC0603(1608)_L]  (hidden comment: 1K 5% 0603(1608))
R73  value 4k7  [RESC0603(1608)_N]  (hidden comment: 4K7 1% 0603(1608))
R74  value 200.00 Ohm  [RESC0603(1608)_L]  (hidden comment: 200R 5% 0603(1608))
SW4  B3S-1000  [OMRON-B3S-1000-4_V]
U8  XC7A35T-2FTG256I  [FTG256]  (part A of 8)

### Ports
0V, 3V3, Config_QSPI (harness QSPI)

### Harnesses
QSPI: QSPI_D0, QSPI_D1, QSPI_D2, QSPI_D3, QSPI_SCK, QSPI_CS

### Nets
0V: C89.1 R59.2 SW4.1 ; port 0V
3V3: R58.1 R73.2 ; port 3V3
Config_QSPI.QSPI_CS: U8.L12(IO_L6P_T0_FCS_B_14) ; port Config_QSPI.QSPI_CS
Config_QSPI.QSPI_D0: U8.J13(IO_L1P_T0_D00_MOSI_14) ; port Config_QSPI.QSPI_D0
Config_QSPI.QSPI_D1: U8.J14(IO_L1N_T0_D01_DIN_14) ; port Config_QSPI.QSPI_D1
Config_QSPI.QSPI_D2: U8.K15(IO_L2P_T0_D02_14) ; port Config_QSPI.QSPI_D2
Config_QSPI.QSPI_D3: U8.K16(IO_L2N_T0_D03_14) ; port Config_QSPI.QSPI_D3
FPGA_EP0: P8.1 U8.R16(IO_L9N_T1_DQS_D13_14)
FPGA_EP1: P8.2 U8.T14(IO_L10P_T1_D14_14)
FPGA_EP2: P8.3 U8.T15(IO_L10N_T1_D15_14)
FPGA_EP3: P8.4 U8.N13(IO_L11P_T1_SRCC_14)
FPGA_EP4: P8.5 U8.P13(IO_L11N_T1_SRCC_14)
FPGA_EP5: P8.6 U8.N14(IO_L12P_T1_MRCC_14)
FPGA_EP6: P8.7 U8.P14(IO_L12N_T1_MRCC_14)
FPGA_EP7: P8.8 U8.N11(IO_L13P_T2_MRCC_14)
FPGA_EP8: P8.9 U8.N12(IO_L13N_T2_MRCC_14)
FPGA_EP9: P8.10 U8.P10(IO_L14P_T2_SRCC_14)
FPGA_EP10: P8.11 U8.P11(IO_L14N_T2_SRCC_14)
FPGA_EP11: P8.12 U8.R12(IO_L15P_T2_DQS_RDWR_B_14)
FPGA_EP12: P8.13 U8.T12(IO_L15N_T2_DQS_DOUT_CSO_B_14)
FPGA_EP13: P8.14 U8.R13(IO_L16P_T2_CSI_B_14)
FPGA_EP14: P8.15 U8.T13(IO_L16N_T2_A15_D31_14)
FPGA_EP15: P8.16 U8.R10(IO_L17P_T2_A14_D30_14)
NetC89_2: C89.2 R73.1 R74.2 U8.T10(IO_L22N_T3_A04_D20_14)
NetR58_2: R58.2 R59.1 U8.L15(IO_L3P_T0_DQS_PUDC_B_14)
NetR74_1: R74.1 SW4.4

Not connected (* = marked no-connect by the designer): SW4 2 3; U8 K12(IO_0_14) K13(IO_L5P_T0_D06_14) L13(IO_L5N_T0_D07_14) L14(IO_L4P_T0_D04_14) M6(IO_L19P_T3_A10_D26_14) M12(IO_L6N_T0_D08_VREF_14) M14(IO_L4N_T0_D05_14) M15(IO_L3N_T0_DQS_EMCCLK_14) M16(IO_L7P_T1_D09_14) N6(IO_L19N_T3_A09_D25_VREF_14) N9(IO_L18P_T2_A12_D28_14) N16(IO_L7N_T1_D10_14) P6(IO_25_14) P8(IO_L20P_T3_A08_D24_14) P9(IO_L18N_T2_A11_D27_14) P15(IO_L8P_T1_D11_14) P16(IO_L8N_T1_D12_14) R5(IO_L23P_T3_A03_D19_14) R6(IO_L24P_T3_A01_D17_14) R7(IO_L24N_T3_A00_D16_14) R8(IO_L20N_T3_A07_D23_14) R11(IO_L17N_T2_A13_D29_14) R15(IO_L9P_T1_DQS_14) T5(IO_L23N_T3_A02_D18_14) T7(IO_L21P_T3_DQS_14) T8(IO_L21N_T3_DQS_A06_D22_14) T9(IO_L22P_T3_A05_D21_14)

### Notes on the sheet
- SCK is connected in BANK0
- PUDC: PullUp During Config. Low = Pull-up on selectIO, High = no Pull-up on SelectIO. Must not float!
  Seems like PUDC=0 means that all IO will have pull-ups during config. Could be nice to have. Most safe option is to insert resistors that will allow selection between them.
  EMCCLK: External Master Config Clock. Optional external clock source for config. Necessary?
- Only load one!
- FCS_B = Flash chip select
- VREF = Input reference voltage for Single-ended I/O standards with differential input buffer. Se UG471, page 18.
  Appears to be a reference for a schmitt-trigger or something, and can be sourced internally, if needed. However, that will mean that the max Vref = 0.9V. Not sure if this is a problem.
- (near SW4) Reset button
  With external (optional) hardware debouncing
- Board:
- Version:
- Sheetname:
- Subject:
- Group:
- Sheet
- of
- Shematic file:
- (in symbol CMP-0383-00025-1, part A) BANK 14

### Library data of the parts
C89 = CMP-1035-02736-1: as C4 on sheet EFM32_power; Technology: SMT; Max Thickness: 1 mm; Rated Voltage: 16 V
P8 = CMP-1024-00437-1: 0.025" SQ Post Header, Through-hole, Vertical, -55 to 125 degC, 2.54 mm Pitch, 16-Pin, Male, RoHS; Manufacturer: Samtec; Pitch: 2.54 mm; ComponentLink1Description: Manufacturer URL; PackageDescription: .025[0.64] SQ. Post Terminal Strip Assembly; PackageReference: TSW-116-08-X-S; PartNumber: TSW-116-08-G-S; ComponentLink2Description: Datasheet; ComponentLink1URL: http://www.samtec.com; Temperature Range: -55 to 125 degC; RoHS: True; PackageVersion: DM, 8/1988; ComponentLink3URL: http://www.samtec.com/documents/webfiles/cpdf/TSW-XXX-XX-XXX-X-XX-XXX-MKT.pdf; ComponentLink2URL: http://www.samtec.com/documents/webfiles/pdf/TSW_TH.PDF; Orientation: Vertical; ComponentLink3Description: Package Specification; Mounting Technology: Through-hole; DatasheetVersion: F-214
R58 R59 = CMP-1012-00074-1: 1K 0.1W 5% 0603 (1608 Metric)  SMD; Case-EIA: 0603; Case-Metric: 1608; Technology: SMT; Tolerance: 5 %; Power: 0.1 W
R73 = CMP-1012-00586-1: 4K7 0.1W 1% 0603 (1608 Metric)  SMD; Case-EIA: 0603; Case-Metric: 1608; Power: 0.1 W; Tolerance: 1 %; Technology: SMT
R74 = CMP-1012-00057-1: 200R 0.1W 5% 0603 (1608 Metric)  SMD; Case-EIA: 0603; Case-Metric: 1608; Technology: SMT; Tolerance: 5 %; Power: 0.1 W
SW4 = CMP-1677-00001-3: as SW1 on sheet EFM32_IO; Packaging: Bulk; PackageDescription: 4-Pin Surface Mount Device, Body 6.6 x 6 mm; Height: 4.3 mm; RoHSCompliant: true; REACH SVHC: No SVHC; Package Quantity: 1500; Mounting Technology: Surface Mount; Contact Plating: Silver; PackageReference: B3S-1000; Min Operating Temperature: -25 degC; DatasheetVersion: 10/2014; Mount: Surface Mount; Length: 6.6 mm; Max Operating Temperature: 70 degC
U8 = CMP-0383-00025-1: as U8 on sheet XC7A35TFTG256_power; ComponentLink3Description: Pinout; ComponentLink4Description: Package Specification; ComponentLink2URL: http://www.xilinx.com/support/documentation/data_sheets/ds180_7Series_Overview.pdf; DatasheetVersion: Rev. 1.15; PackageVersion: Rev. 1.11; ComponentLink3URL: http://www.xilinx.com/support/documentation/user_guides/ug475_7Series_Pkg_Pinout.pdf; ComponentLink1Description: Manufacturer URL; PackageReference: FTG-256; ComponentLink1URL: http://www.xilinx.com/; ComponentLink4URL: http://www.xilinx.com/support/documentation/user_guides/ug475_7Series_Pkg_Pinout.pdf; Mounting Technology: Surface Mount; Maximum Distributed RAM: 400 Kb; PackageDescription: 256-Ball Wire-Bond Fine-Pitch Thin BGA, Body 17 x 17 mm, Pitch 1 mm; ComponentLink2Description: Datasheet; Operating Temperature Range: Industrial; PartNumber: XC7A35T-2FTG256I; PartId: 1

## Sheet XC7A35TFTG256_bank0.SchDoc
size A4; DocumentNumber: 15; SheetNumber: 15; SheetTotal: 21; SheetName: FPGA Bank 0
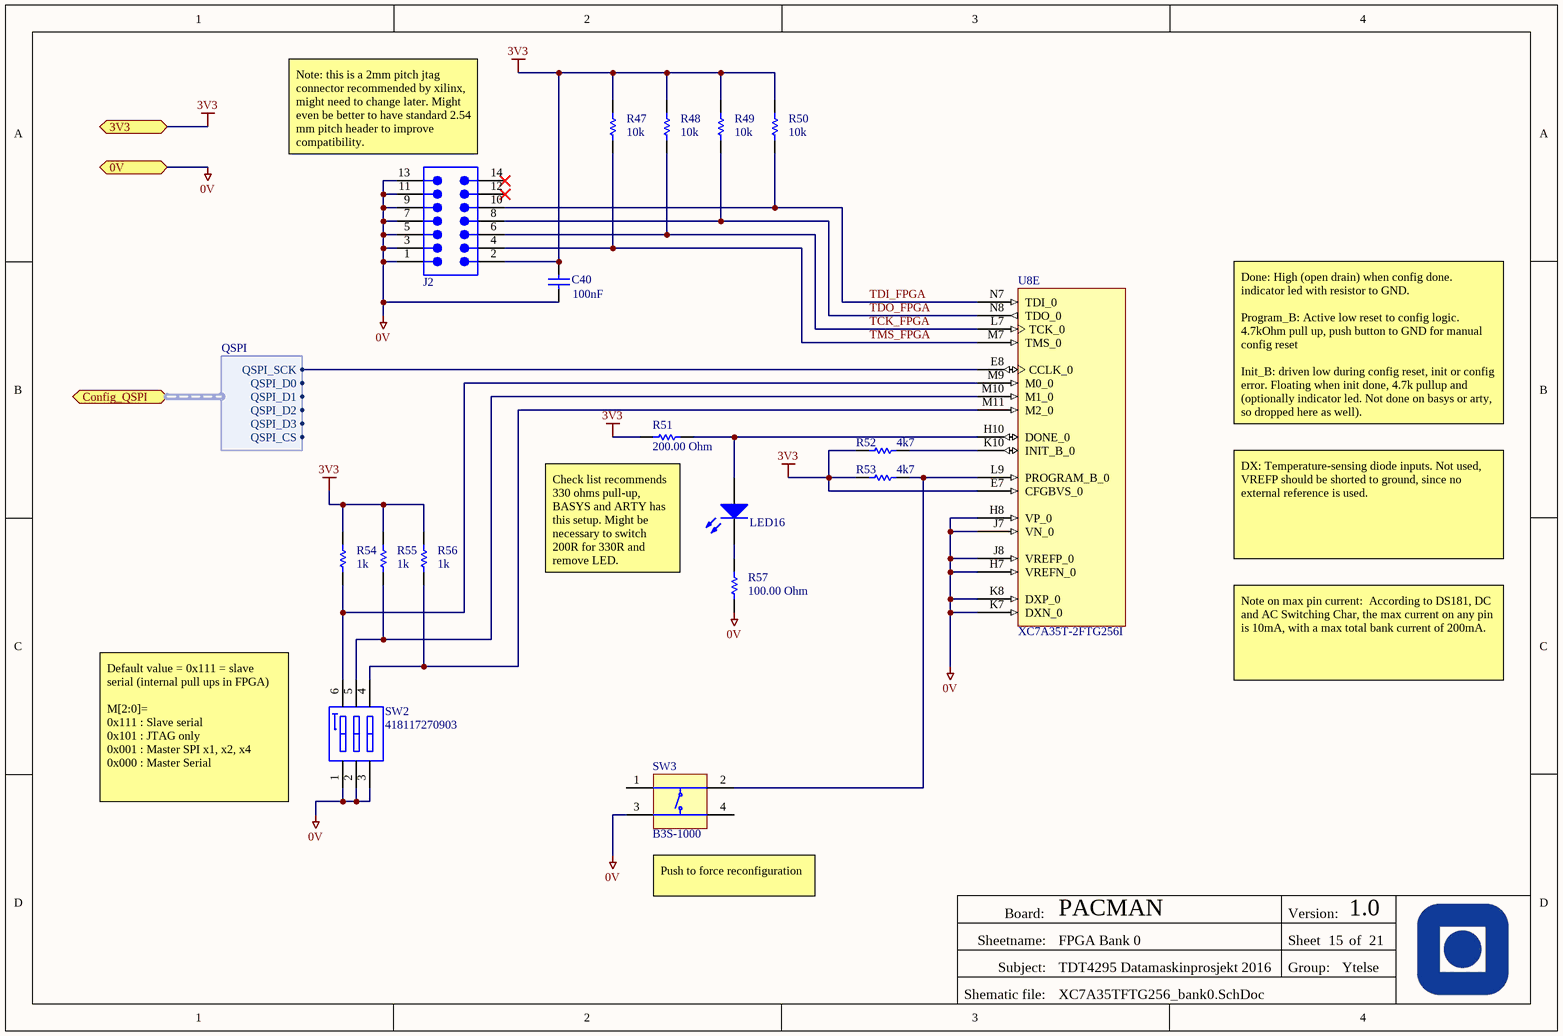
[diagram p8: XC7A35TFTG256_bank0.SchDoc]

### Parts
C40  value 100nF  [CAPC0603(1608)100_M]  (hidden comment: CAP 100nF 16V 0603(1608))
J2  2x7 2mm header  [2x7 2mm]  (value not drawn)
LED16  150060RS75000  [0603_A]  (value not drawn)
R47  value 10k  [RESC0603(1608)_N]  (hidden comment: 10K 5% 0603(1608))
R48  value 10k  [RESC0603(1608)_N]  (hidden comment: 10K 5% 0603(1608))
R49  value 10k  [RESC0603(1608)_N]  (hidden comment: 10K 5% 0603(1608))
R50  value 10k  [RESC0603(1608)_N]  (hidden comment: 10K 5% 0603(1608))
R51  value 200.00 Ohm  [RESC0603(1608)_L]  (hidden comment: 200R 5% 0603(1608))
R52  value 4k7  [RESC0603(1608)_N]  (hidden comment: 4K7 1% 0603(1608))
R53  value 4k7  [RESC0603(1608)_N]  (hidden comment: 4K7 1% 0603(1608))
R54  value 1k  [RESC0603(1608)_L]  (hidden comment: 1K 5% 0603(1608))
R55  value 1k  [RESC0603(1608)_L]  (hidden comment: 1K 5% 0603(1608))
R56  value 1k  [RESC0603(1608)_L]  (hidden comment: 1K 5% 0603(1608))
R57  value 100.00 Ohm  [RESC0603(1608)_L]  (hidden comment: 100R 5% 0603(1608))
SW2  418117270903  [418117270903]
SW3  B3S-1000  [OMRON-B3S-1000-4_V]
U8  XC7A35T-2FTG256I  [FTG256]  (part E of 8)

### Ports
0V, 3V3, Config_QSPI (harness QSPI)

### Harnesses
QSPI: QSPI_D0, QSPI_D1, QSPI_D2, QSPI_D3, QSPI_SCK, QSPI_CS

### Nets
0V: C40.1 J2.1 J2.3 J2.5 J2.7 J2.9 J2.11 J2.13 R57.1 SW2.1 SW2.2 SW2.3 SW3.3 U8.H7(VREFN_0) U8.H8(VP_0) U8.J7(VN_0) U8.J8(VREFP_0) U8.K7(DXN_0) U8.K8(DXP_0) ; port 0V
3V3: C40.2 J2.2 R47.2 R48.2 R49.2 R50.2 R51.1 R52.1 R53.1 R54.2 R55.2 R56.2 U8.E7(CFGBVS_0) ; port 3V3
Config_QSPI.QSPI_SCK: U8.E8(CCLK_0) ; port Config_QSPI.QSPI_SCK
TCK_FPGA: J2.6 R48.1 U8.L7(TCK_0)
TDI_FPGA: J2.10 R50.1 U8.N7(TDI_0)
TDO_FPGA: J2.8 R49.1 U8.N8(TDO_0)
TMS_FPGA: J2.4 R47.1 U8.M7(TMS_0)
NetLED16_1: LED16.1(K) R57.2
NetLED16_2: LED16.2(A) R51.2 U8.H10(DONE_0)
NetR52_2: R52.2 U8.K10(INIT_B_0)
NetR53_2: R53.2 SW3.2 U8.L9(PROGRAM_B_0)
NetR54_1: R54.1 SW2.6 U8.M9(M0_0)
NetR55_1: R55.1 SW2.5 U8.M10(M1_0)
NetR56_1: R56.1 SW2.4 U8.M11(M2_0)

Not connected (* = marked no-connect by the designer): J2 12* 14*; SW3 1 4

### Notes on the sheet
- (near J2) Note: this is a 2mm pitch jtag connector recommended by xilinx, might need to change later. Might even be better to have standard 2.54 mm pitch header to improve compatibility.
- Done: High (open drain) when config done. indicator led with resistor to GND.
  Program_B: Active low reset to config logic. 4.7kOhm pull up, push button to GND for manual config reset
  Init_B: driven low during config reset, init or config error. Floating when init done, 4.7k pullup and (optionally indicator led. Not done on basys or arty, so dropped here as well).
- (near R51) Check list recommends 330 ohms pull-up, BASYS and ARTY has this setup. Might be necessary to switch 200R for 330R and remove LED.
- DX: Temperature-sensing diode inputs. Not used,
  VREFP should be shorted to ground, since no external reference is used.
- Note on max pin current:  According to DS181, DC and AC Switching Char, the max current on any pin is 10mA, with a max total bank current of 200mA.
- Default value = 0x111 = slave serial (internal pull ups in FPGA)
  M[2:0]=
  0x111 : Slave serial
  0x101 : JTAG only
  0x001 : Master SPI x1, x2, x4
  0x000 : Master Serial
- (near SW3) Push to force reconfiguration
- Board:
- Version:
- Sheetname:
- Subject:
- Group:
- Sheet
- of
- Shematic file:

### Library data of the parts
C40 = CMP-1035-02583-1: as C6 on sheet EFM32_power; Rated Voltage: 16 V; Max Thickness: 1 mm; Technology: SMT
J2 = 2x7 2mm header: 2 x 7 2mm pitch vertical header; Supplier 1: Digi-Key; Supplier Part Number 1: WM17469-ND
LED16 = CMP-1426-00001-1: SMD mono-color Chip LED, WL-SMCW, Red; Manufacturer: Wuerth Elektronik; Color: Red; PackageReference: 0603_A; ComponentLink2URL: http://katalog.we-online.com/led/datasheet/150060RS75000.pdf; ComponentLink1URL: http://www.we-online.com; ComponentLink1Description: Manufacturer URL; ComponentLink2Description: Datasheet; PartNumber: 150060RS75000
R47-R50 = CMP-1012-00098-1: 10K 0.1W 5% 0603 (1608 Metric)  SMD; Case-EIA: 0603; Case-Metric: 1608; Technology: SMT; Tolerance: 5 %; Power: 0.1 W
R51 = CMP-1012-00057-1: as R74 on sheet XC7A35TFTG256_bank14; Technology: SMT; Tolerance: 5 %; Power: 0.1 W
R52 R53 = CMP-1012-00586-1: as R73 on sheet XC7A35TFTG256_bank14; Power: 0.1 W; Tolerance: 1 %; Technology: SMT
R54-R56 = CMP-1012-00074-1: as R58 on sheet XC7A35TFTG256_bank14; Technology: SMT; Tolerance: 5 %; Power: 0.1 W
R57 = CMP-1012-00050-1: 100R 0.1W 5% 0603 (1608 Metric)  SMD; Case-EIA: 0603; Case-Metric: 1608; Tolerance: 5 %; Technology: SMT; Power: 0.1 W
SW2 = CMP-1435-00003-1: WS-DITV 2.54 mm Compact THT Dip Switch with Raised Actuator; Manufacturer: Wuerth Elektronik; NoPins: 6; PackageReference: 418117270903; ComponentLink2Description: Datasheet; ComponentLink1URL: http://www.we-online.com; ComponentLink1Description: Manufacturer URL; PartNumber: 418117270903; ComponentLink2URL: http://katalog.we-online.de/em/datasheet/4181172709xx.pdf
SW3 = CMP-1677-00001-3: as SW1 on sheet EFM32_IO; Packaging: Bulk; PackageDescription: 4-Pin Surface Mount Device, Body 6.6 x 6 mm; Height: 4.3 mm; RoHSCompliant: true; REACH SVHC: No SVHC; Package Quantity: 1500; Mounting Technology: Surface Mount; Contact Plating: Silver; PackageReference: B3S-1000; Min Operating Temperature: -25 degC; DatasheetVersion: 10/2014; Mount: Surface Mount; Length: 6.6 mm; Max Operating Temperature: 70 degC
U8 = CMP-0383-00025-1: as U8 on sheet XC7A35TFTG256_power; ComponentLink3Description: Pinout; ComponentLink4Description: Package Specification; ComponentLink2URL: http://www.xilinx.com/support/documentation/data_sheets/ds180_7Series_Overview.pdf; DatasheetVersion: Rev. 1.15; PackageVersion: Rev. 1.11; ComponentLink3URL: http://www.xilinx.com/support/documentation/user_guides/ug475_7Series_Pkg_Pinout.pdf; ComponentLink1Description: Manufacturer URL; PackageReference: FTG-256; ComponentLink1URL: http://www.xilinx.com/; ComponentLink4URL: http://www.xilinx.com/support/documentation/user_guides/ug475_7Series_Pkg_Pinout.pdf; Mounting Technology: Surface Mount; Maximum Distributed RAM: 400 Kb; PackageDescription: 256-Ball Wire-Bond Fine-Pitch Thin BGA, Body 17 x 17 mm, Pitch 1 mm; ComponentLink2Description: Datasheet; Operating Temperature Range: Industrial; PartNumber: XC7A35T-2FTG256I; PartId: 1

## Sheet XC7A35TFTG256_IO.SchDoc
size A4; DocumentNumber: 17; SheetNumber: 17; SheetTotal: 21; SheetName: FPGA IO Top level
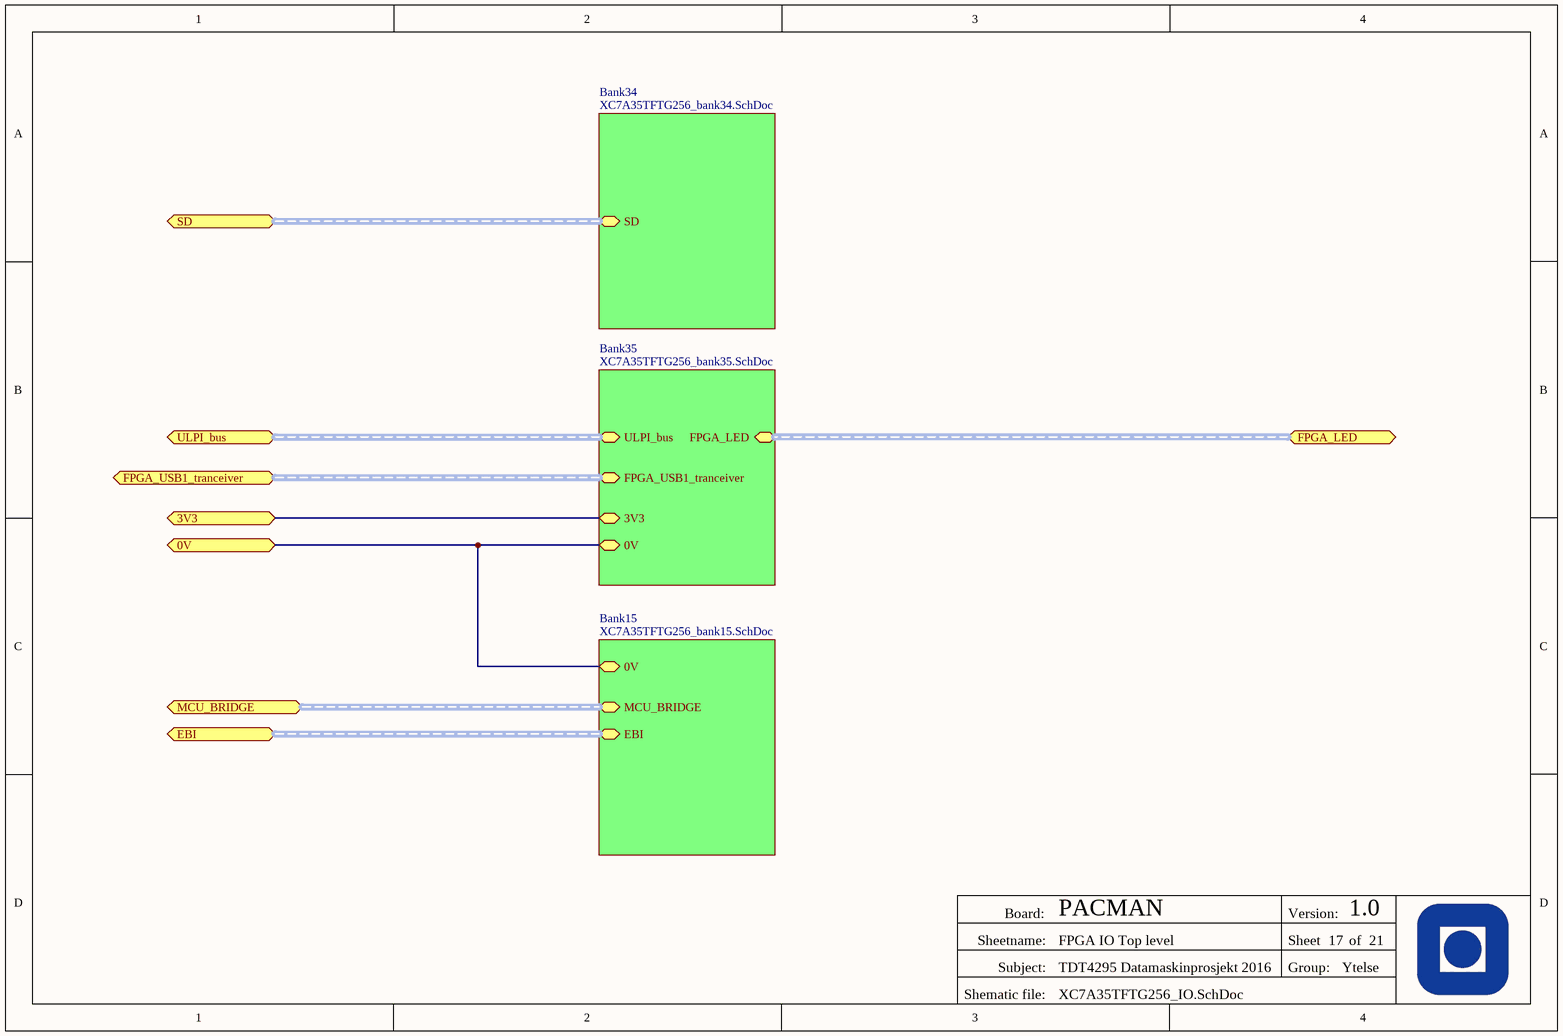
[diagram p9: XC7A35TFTG256_IO.SchDoc]

### Sub-sheets
Bank15 = XC7A35TFTG256_bank15.SchDoc: MCU_BRIDGE (harness MCU_CTRL_LOGIC), EBI (harness EBI), 0V
Bank34 = XC7A35TFTG256_bank34.SchDoc: SD (harness SD_card)
Bank35 = XC7A35TFTG256_bank35.SchDoc: ULPI_bus (harness ULPI), FPGA_USB1_tranceiver (harness USB1_FS_harness), FPGA_LED, 3V3, 0V

### Ports
0V, 3V3, EBI (harness EBI), FPGA_LED (harness LED_Harness), FPGA_USB1_tranceiver (harness USB1_FS_harness), MCU_BRIDGE (harness MCU_CTRL_LOGIC), SD (harness Sd_card), ULPI_bus (harness ULPI)

### Nets
0V: port 0V, sheet Bank15/0V, sheet Bank35/0V
3V3: port 3V3, sheet Bank35/3V3

### Buses and harness runs
harness port EBI = sheet Bank15/EBI
harness port FPGA_LED = sheet Bank35/FPGA_LED
harness port FPGA_USB1_tranceiver = sheet Bank35/FPGA_USB1_tranceiver
harness port MCU_BRIDGE = sheet Bank15/MCU_BRIDGE
harness port SD = sheet Bank34/SD
harness port ULPI_bus = sheet Bank35/ULPI_bus

### Notes on the sheet
- Board:
- Version:
- Sheetname:
- Subject:
- Group:
- Sheet
- of
- Shematic file:

## Sheet XC7A35TFTG256_bank15.SchDoc
size A4; DocumentNumber: 18; SheetNumber: 18; SheetTotal: 21; SheetName: FPGA Bank 15
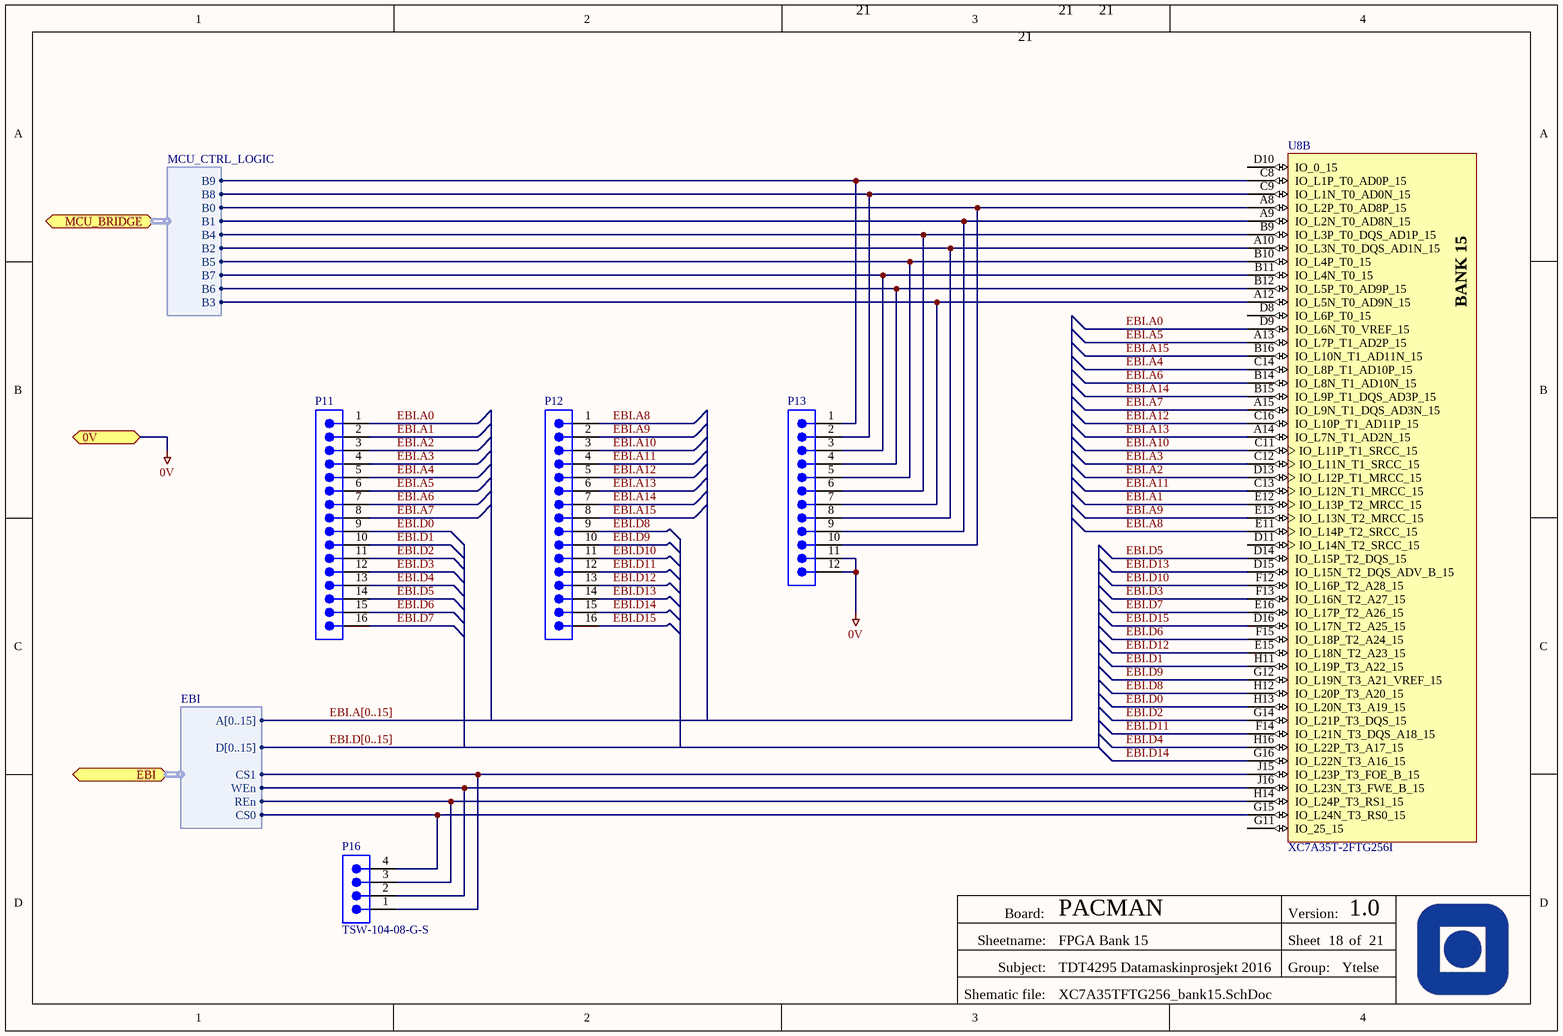
[diagram p10: XC7A35TFTG256_bank15.SchDoc]

### Parts
P11  MTLW-116-07-F-S-265  [SMTC-MTLW-116-07-X-S-265]  (value not drawn)
P12  MTLW-116-07-F-S-265  [SMTC-MTLW-116-07-X-S-265]  (value not drawn)
P13  MTLW-112-07-L-S-125  [SMTC-MTLW-112-07-X-S-125]  (value not drawn)
P16  TSW-104-08-G-S  [SMTC-TSW-104-08-X-S]
U8  XC7A35T-2FTG256I  [FTG256]  (part B of 8)

### Ports
0V, EBI (harness EBI), MCU_BRIDGE (harness MCU_CTRL_LOGIC)

### Harnesses
EBI: A[0..15], D[0..15], CS0, CS1, REn, WEn
MCU_CTRL_LOGIC: B0, B1, B2, B3, B4, B5, B6, B7, B8, B9

### Nets
0V: P13.11 P13.12 ; port 0V
EBI.A0: P11.1 U8.D9(IO_L6N_T0_VREF_15)
EBI.A1: P11.2 U8.E12(IO_L13P_T2_MRCC_15)
EBI.A2: P11.3 U8.D13(IO_L12P_T1_MRCC_15)
EBI.A3: P11.4 U8.C12(IO_L11N_T1_SRCC_15)
EBI.A4: P11.5 U8.C14(IO_L8P_T1_AD10P_15)
EBI.A5: P11.6 U8.A13(IO_L7P_T1_AD2P_15)
EBI.A6: P11.7 U8.B14(IO_L8N_T1_AD10N_15)
EBI.A7: P11.8 U8.A15(IO_L9N_T1_DQS_AD3N_15)
EBI.A8: P12.1 U8.E11(IO_L14P_T2_SRCC_15)
EBI.A9: P12.2 U8.E13(IO_L13N_T2_MRCC_15)
EBI.A10: P12.3 U8.C11(IO_L11P_T1_SRCC_15)
EBI.A11: P12.4 U8.C13(IO_L12N_T1_MRCC_15)
EBI.A12: P12.5 U8.C16(IO_L10P_T1_AD11P_15)
EBI.A13: P12.6 U8.A14(IO_L7N_T1_AD2N_15)
EBI.A14: P12.7 U8.B15(IO_L9P_T1_DQS_AD3P_15)
EBI.A15: P12.8 U8.B16(IO_L10N_T1_AD11N_15)
EBI.CS0: P16.4 U8.G15(IO_L24N_T3_RS0_15) ; port EBI.CS0
EBI.CS1: P16.1 U8.J15(IO_L23P_T3_FOE_B_15) ; port EBI.CS1
EBI.D0: P11.9 U8.H13(IO_L20N_T3_A19_15)
EBI.D1: P11.10 U8.H11(IO_L19P_T3_A22_15)
EBI.D2: P11.11 U8.G14(IO_L21P_T3_DQS_15)
EBI.D3: P11.12 U8.F13(IO_L16N_T2_A27_15)
EBI.D4: P11.13 U8.H16(IO_L22P_T3_A17_15)
EBI.D5: P11.14 U8.D14(IO_L15P_T2_DQS_15)
EBI.D6: P11.15 U8.F15(IO_L18P_T2_A24_15)
EBI.D7: P11.16 U8.E16(IO_L17P_T2_A26_15)
EBI.D8: P12.9 U8.H12(IO_L20P_T3_A20_15)
EBI.D9: P12.10 U8.G12(IO_L19N_T3_A21_VREF_15)
EBI.D10: P12.11 U8.F12(IO_L16P_T2_A28_15)
EBI.D11: P12.12 U8.F14(IO_L21N_T3_DQS_A18_15)
EBI.D12: P12.13 U8.E15(IO_L18N_T2_A23_15)
EBI.D13: P12.14 U8.D15(IO_L15N_T2_DQS_ADV_B_15)
EBI.D14: P12.15 U8.G16(IO_L22N_T3_A16_15)
EBI.D15: P12.16 U8.D16(IO_L17N_T2_A25_15)
EBI.REn: P16.3 U8.H14(IO_L24P_T3_RS1_15) ; port EBI.REn
EBI.WEn: P16.2 U8.J16(IO_L23N_T3_FWE_B_15) ; port EBI.WEn
MCU_BRIDGE.B0: P13.10 U8.A8(IO_L2P_T0_AD8P_15) ; port MCU_BRIDGE.B0
MCU_BRIDGE.B1: P13.9 U8.A9(IO_L2N_T0_AD8N_15) ; port MCU_BRIDGE.B1
MCU_BRIDGE.B2: P13.8 U8.A10(IO_L3N_T0_DQS_AD1N_15) ; port MCU_BRIDGE.B2
MCU_BRIDGE.B3: P13.7 U8.A12(IO_L5N_T0_AD9N_15) ; port MCU_BRIDGE.B3
MCU_BRIDGE.B4: P13.6 U8.B9(IO_L3P_T0_DQS_AD1P_15) ; port MCU_BRIDGE.B4
MCU_BRIDGE.B5: P13.5 U8.B10(IO_L4P_T0_15) ; port MCU_BRIDGE.B5
MCU_BRIDGE.B6: P13.4 U8.B12(IO_L5P_T0_AD9P_15) ; port MCU_BRIDGE.B6
MCU_BRIDGE.B7: P13.3 U8.B11(IO_L4N_T0_15) ; port MCU_BRIDGE.B7
MCU_BRIDGE.B8: P13.2 U8.C9(IO_L1N_T0_AD0N_15) ; port MCU_BRIDGE.B8
MCU_BRIDGE.B9: P13.1 U8.C8(IO_L1P_T0_AD0P_15) ; port MCU_BRIDGE.B9

Not connected (* = marked no-connect by the designer): U8 D8(IO_L6P_T0_15) D10(IO_0_15) D11(IO_L14N_T2_SRCC_15) G11(IO_25_15)

### Buses and harness runs
bus EBI.A[0..15]
bus EBI.D[0..15]

### Notes on the sheet
- Board:
- Version:
- Sheetname:
- Subject:
- Group:
- Sheet
- of
- Shematic file:
- (in symbol CMP-0383-00025-1, part B) BANK 15

### Library data of the parts
P11 P12 = CMP-1024-00094-1: Manufacturer: Samtec; Pitch: 2.54 mm; Temperature Range: -55 to 125 degC; ComponentLink2URL: http://www.samtec.com/documents/webfiles/pdf/MTLW_TH.PDF; ComponentLink3URL: http://www.samtec.com/documents/webfiles/cpdf/MTLW-1XX-XX-XX-X-XXX-XX-XX-MKT1.pdf; PackageVersion: T, 6/1991; ComponentLink1Description: Manufacturer URL; PackageDescription: Low Profile Terminal Assembly; RoHS: True; ComponentLink2Description: Datasheet; PackageReference: MTLW-116-07-X-S-265; PartNumber: MTLW-116-07-F-S-265; Mounting Technology: Through-hole; DatasheetVersion: F-214; Orientation: Vertical; ComponentLink3Description: Package Specification; ComponentLink1URL: http://www.samtec.com
P13 = CMP-1024-00087-1: Manufacturer: Samtec; Pitch: 2.54 mm; Mounting Technology: Through-hole; ComponentLink2URL: http://www.samtec.com/documents/webfiles/pdf/MTLW_TH.PDF; Temperature Range: -55 to 125 degC; PackageVersion: T, 6/1991; ComponentLink3Description: Package Specification; DatasheetVersion: F-214; PartNumber: MTLW-112-07-L-S-125; ComponentLink1URL: http://www.samtec.com; PackageReference: MTLW-112-07-X-S-125; ComponentLink3URL: http://www.samtec.com/documents/webfiles/cpdf/MTLW-1XX-XX-XX-X-XXX-XX-XX-MKT1.pdf; PackageDescription: Low Profile Terminal Assembly; ComponentLink1Description: Manufacturer URL; RoHS: True; ComponentLink2Description: Datasheet; Orientation: Vertical
P16 = CMP-1024-00357-1: 0.025" SQ Post Header, Through-hole, Vertical, -55 to 125 degC, 2.54 mm Pitch, 4-Pin, Male, RoHS; Manufacturer: Samtec; Pitch: 2.54 mm; RoHS: True; ComponentLink3URL: http://www.samtec.com/documents/webfiles/cpdf/TSW-XXX-XX-XXX-X-XX-XXX-MKT.pdf; Mounting Technology: Through-hole; ComponentLink2URL: http://www.samtec.com/documents/webfiles/pdf/TSW_TH.PDF; ComponentLink1URL: http://www.samtec.com; ComponentLink3Description: Package Specification; PackageVersion: DM, 8/1988; ComponentLink2Description: Datasheet; PackageReference: TSW-104-08-X-S; PackageDescription: .025[0.64] SQ. Post Terminal Strip Assembly; PartNumber: TSW-104-08-G-S; ComponentLink1Description: Manufacturer URL; Temperature Range: -55 to 125 degC; DatasheetVersion: F-214; Orientation: Vertical
U8 = CMP-0383-00025-1: as U8 on sheet XC7A35TFTG256_power; ComponentLink3Description: Pinout; ComponentLink4Description: Package Specification; ComponentLink2URL: http://www.xilinx.com/support/documentation/data_sheets/ds180_7Series_Overview.pdf; DatasheetVersion: Rev. 1.15; PackageVersion: Rev. 1.11; ComponentLink3URL: http://www.xilinx.com/support/documentation/user_guides/ug475_7Series_Pkg_Pinout.pdf; ComponentLink1Description: Manufacturer URL; PackageReference: FTG-256; ComponentLink1URL: http://www.xilinx.com/; ComponentLink4URL: http://www.xilinx.com/support/documentation/user_guides/ug475_7Series_Pkg_Pinout.pdf; Mounting Technology: Surface Mount; Maximum Distributed RAM: 400 Kb; PackageDescription: 256-Ball Wire-Bond Fine-Pitch Thin BGA, Body 17 x 17 mm, Pitch 1 mm; ComponentLink2Description: Datasheet; Operating Temperature Range: Industrial; PartNumber: XC7A35T-2FTG256I; PartId: 1

## Sheet XC7A35TFTG256_bank34.SchDoc
size A4; DocumentNumber: 19; SheetNumber: 19; SheetTotal: 21; SheetName: FPGA Bank 34
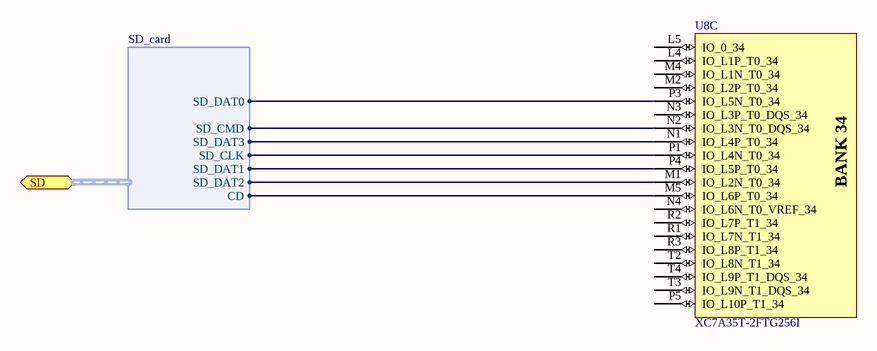
[diagram p11: XC7A35TFTG256_bank34.SchDoc]

### Parts
U8  XC7A35T-2FTG256I  [FTG256]  (part C of 8)

### Ports
SD (harness SD_card)

### Harnesses
SD_card: SD_CMD, SD_CLK, SD_DAT0, SD_DAT1, SD_DAT2, SD_DAT3, CD

### Nets
SD.CD: U8.M5(IO_L6P_T0_34) ; port SD.CD
SD.SD_CLK: U8.P1(IO_L4N_T0_34) ; port SD.SD_CLK
SD.SD_CMD: U8.N2(IO_L3N_T0_DQS_34) ; port SD.SD_CMD
SD.SD_DAT0: U8.P3(IO_L5N_T0_34) ; port SD.SD_DAT0
SD.SD_DAT1: U8.P4(IO_L5P_T0_34) ; port SD.SD_DAT1
SD.SD_DAT2: U8.M1(IO_L2N_T0_34) ; port SD.SD_DAT2
SD.SD_DAT3: U8.N1(IO_L4P_T0_34) ; port SD.SD_DAT3

Not connected (* = marked no-connect by the designer): U8 L4(IO_L1P_T0_34) L5(IO_0_34) M2(IO_L2P_T0_34) M4(IO_L1N_T0_34) N3(IO_L3P_T0_DQS_34) N4(IO_L6N_T0_VREF_34) P5(IO_L10P_T1_34) R1(IO_L7N_T1_34) R2(IO_L7P_T1_34) R3(IO_L8P_T1_34) T2(IO_L8N_T1_34) T3(IO_L9N_T1_DQS_34) T4(IO_L9P_T1_DQS_34)

### Notes on the sheet
- Board:
- Version:
- Sheetname:
- Subject:
- Group:
- Sheet
- of
- Shematic file:
- (in symbol CMP-0383-00025-1, part C) BANK 34

### Library data of the parts
U8 = CMP-0383-00025-1: as U8 on sheet XC7A35TFTG256_power; ComponentLink3Description: Pinout; ComponentLink4Description: Package Specification; ComponentLink2URL: http://www.xilinx.com/support/documentation/data_sheets/ds180_7Series_Overview.pdf; DatasheetVersion: Rev. 1.15; PackageVersion: Rev. 1.11; ComponentLink3URL: http://www.xilinx.com/support/documentation/user_guides/ug475_7Series_Pkg_Pinout.pdf; ComponentLink1Description: Manufacturer URL; PackageReference: FTG-256; ComponentLink1URL: http://www.xilinx.com/; ComponentLink4URL: http://www.xilinx.com/support/documentation/user_guides/ug475_7Series_Pkg_Pinout.pdf; Mounting Technology: Surface Mount; Maximum Distributed RAM: 400 Kb; PackageDescription: 256-Ball Wire-Bond Fine-Pitch Thin BGA, Body 17 x 17 mm, Pitch 1 mm; ComponentLink2Description: Datasheet; Operating Temperature Range: Industrial; PartNumber: XC7A35T-2FTG256I; PartId: 1